# EAGLE design LARIX_V3_finish (EAGLE 6.5.0)
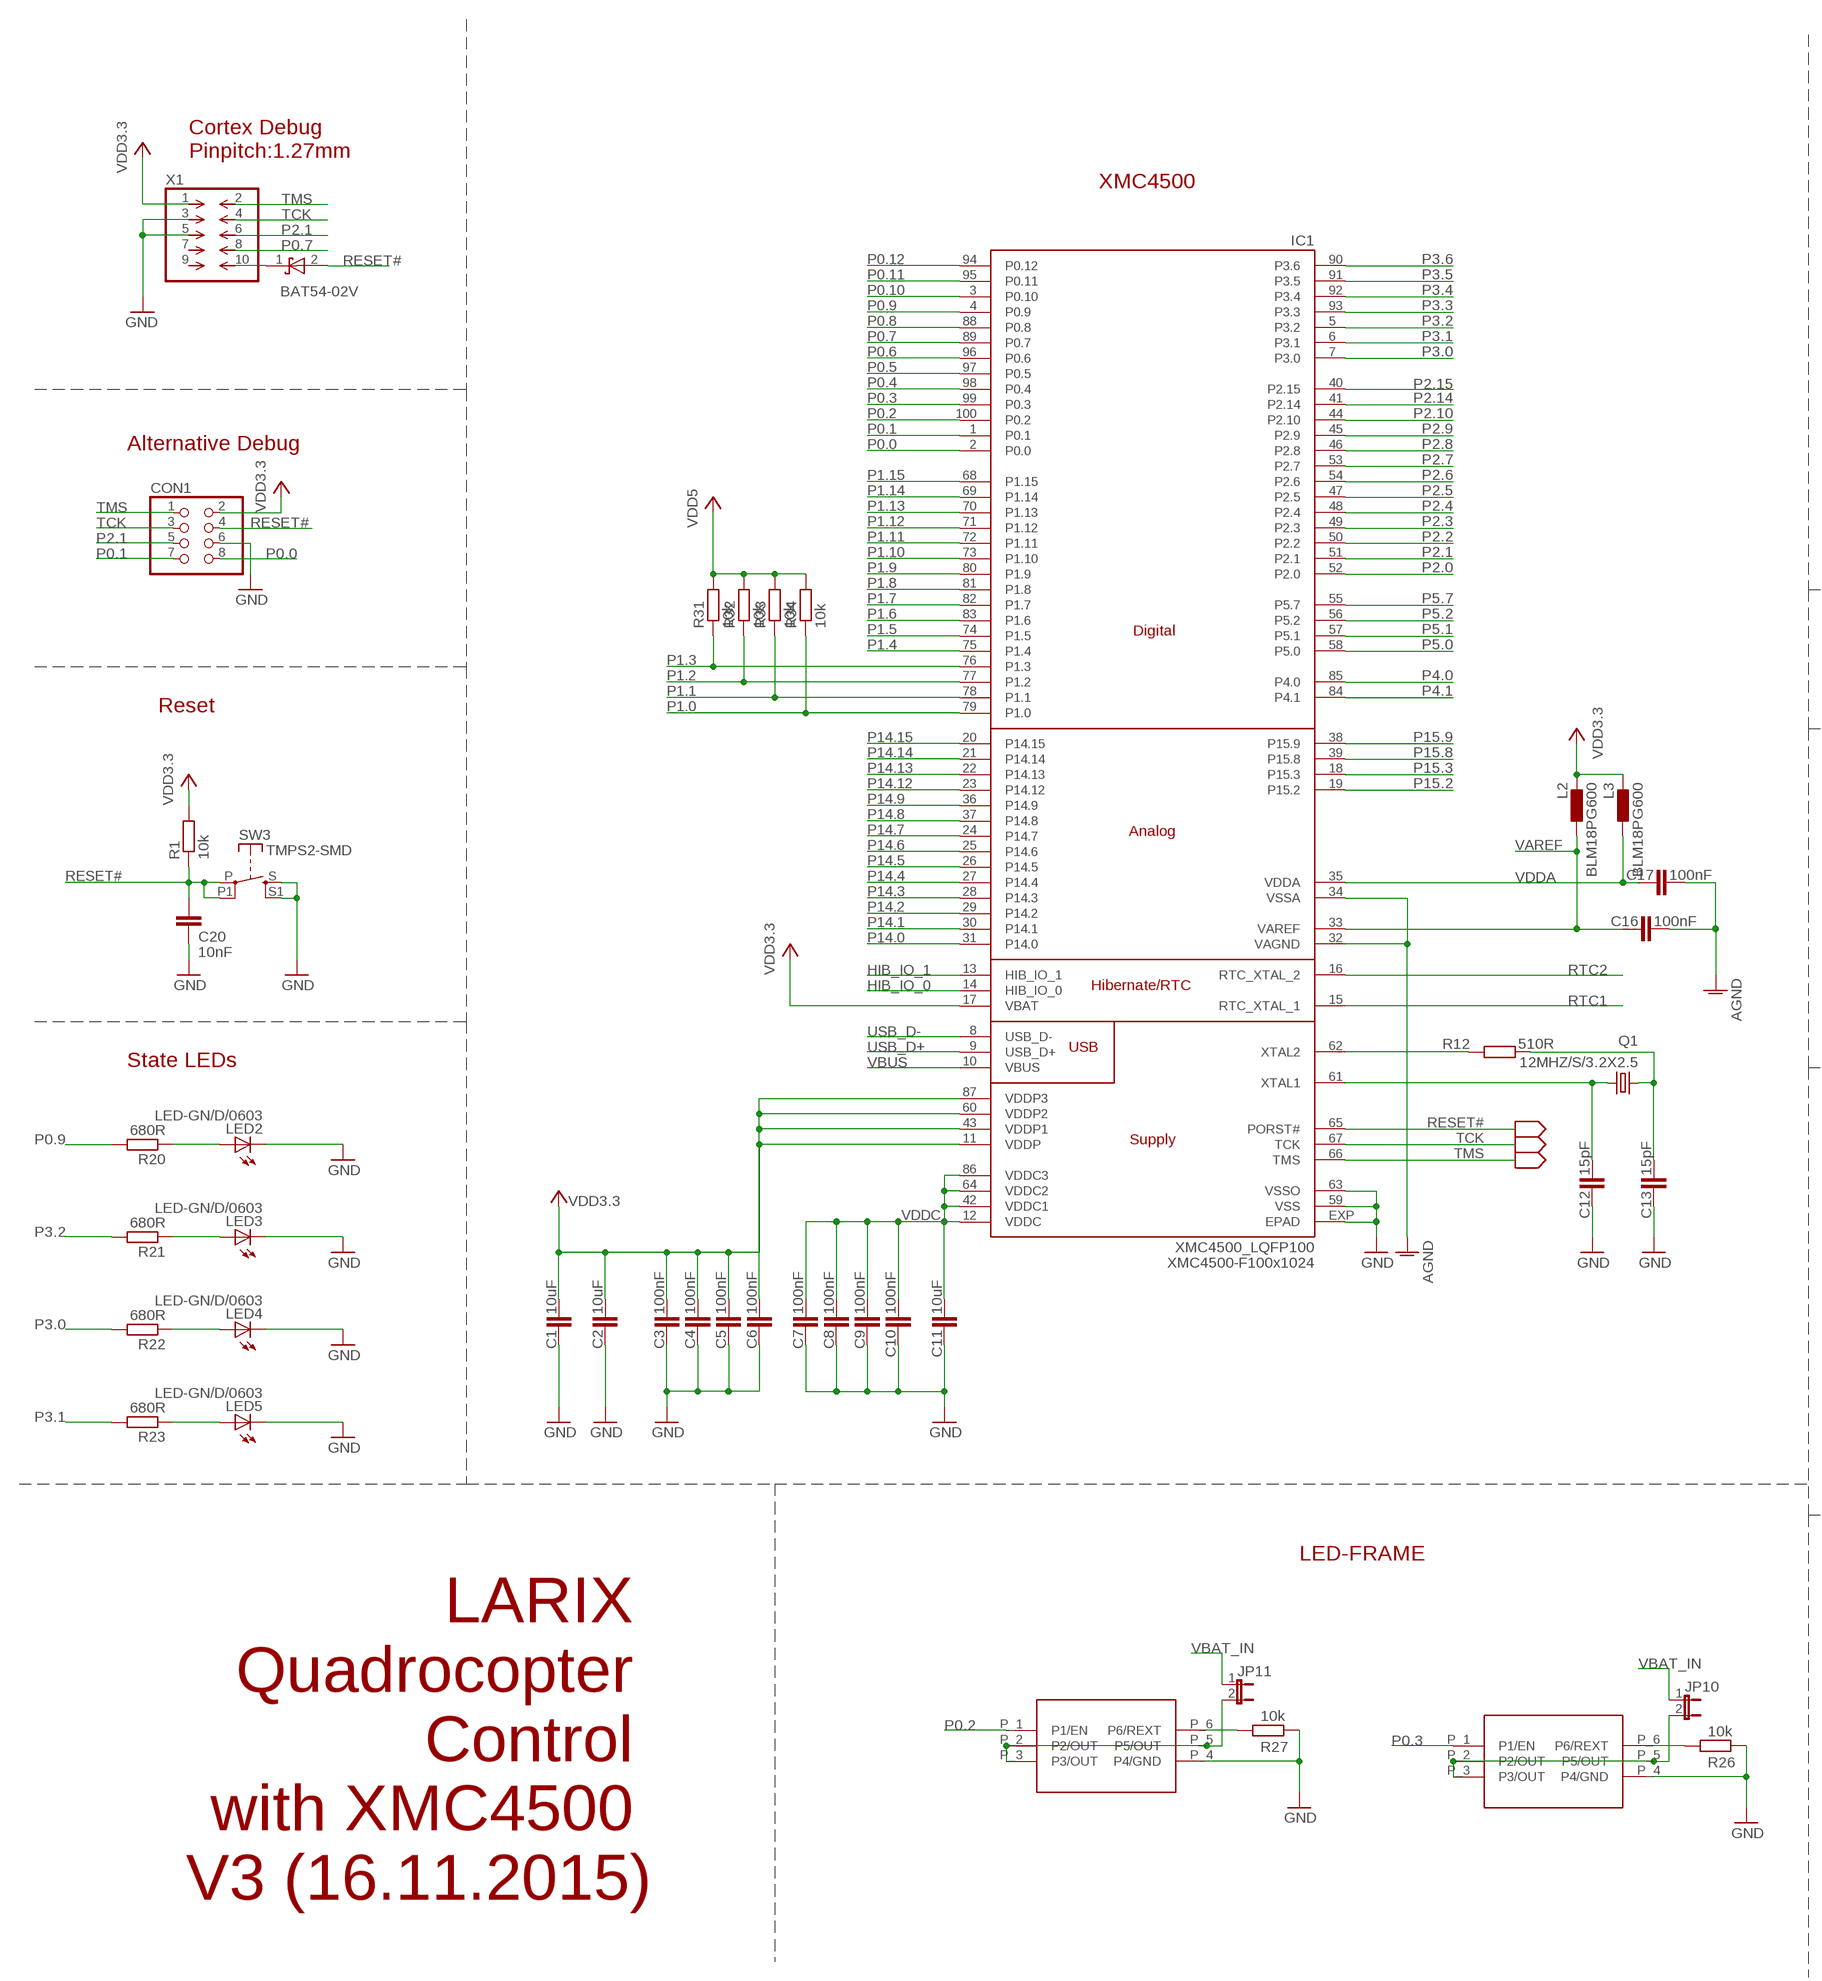
[diagram p0: schematic, sheet 1, part 1 of 2]
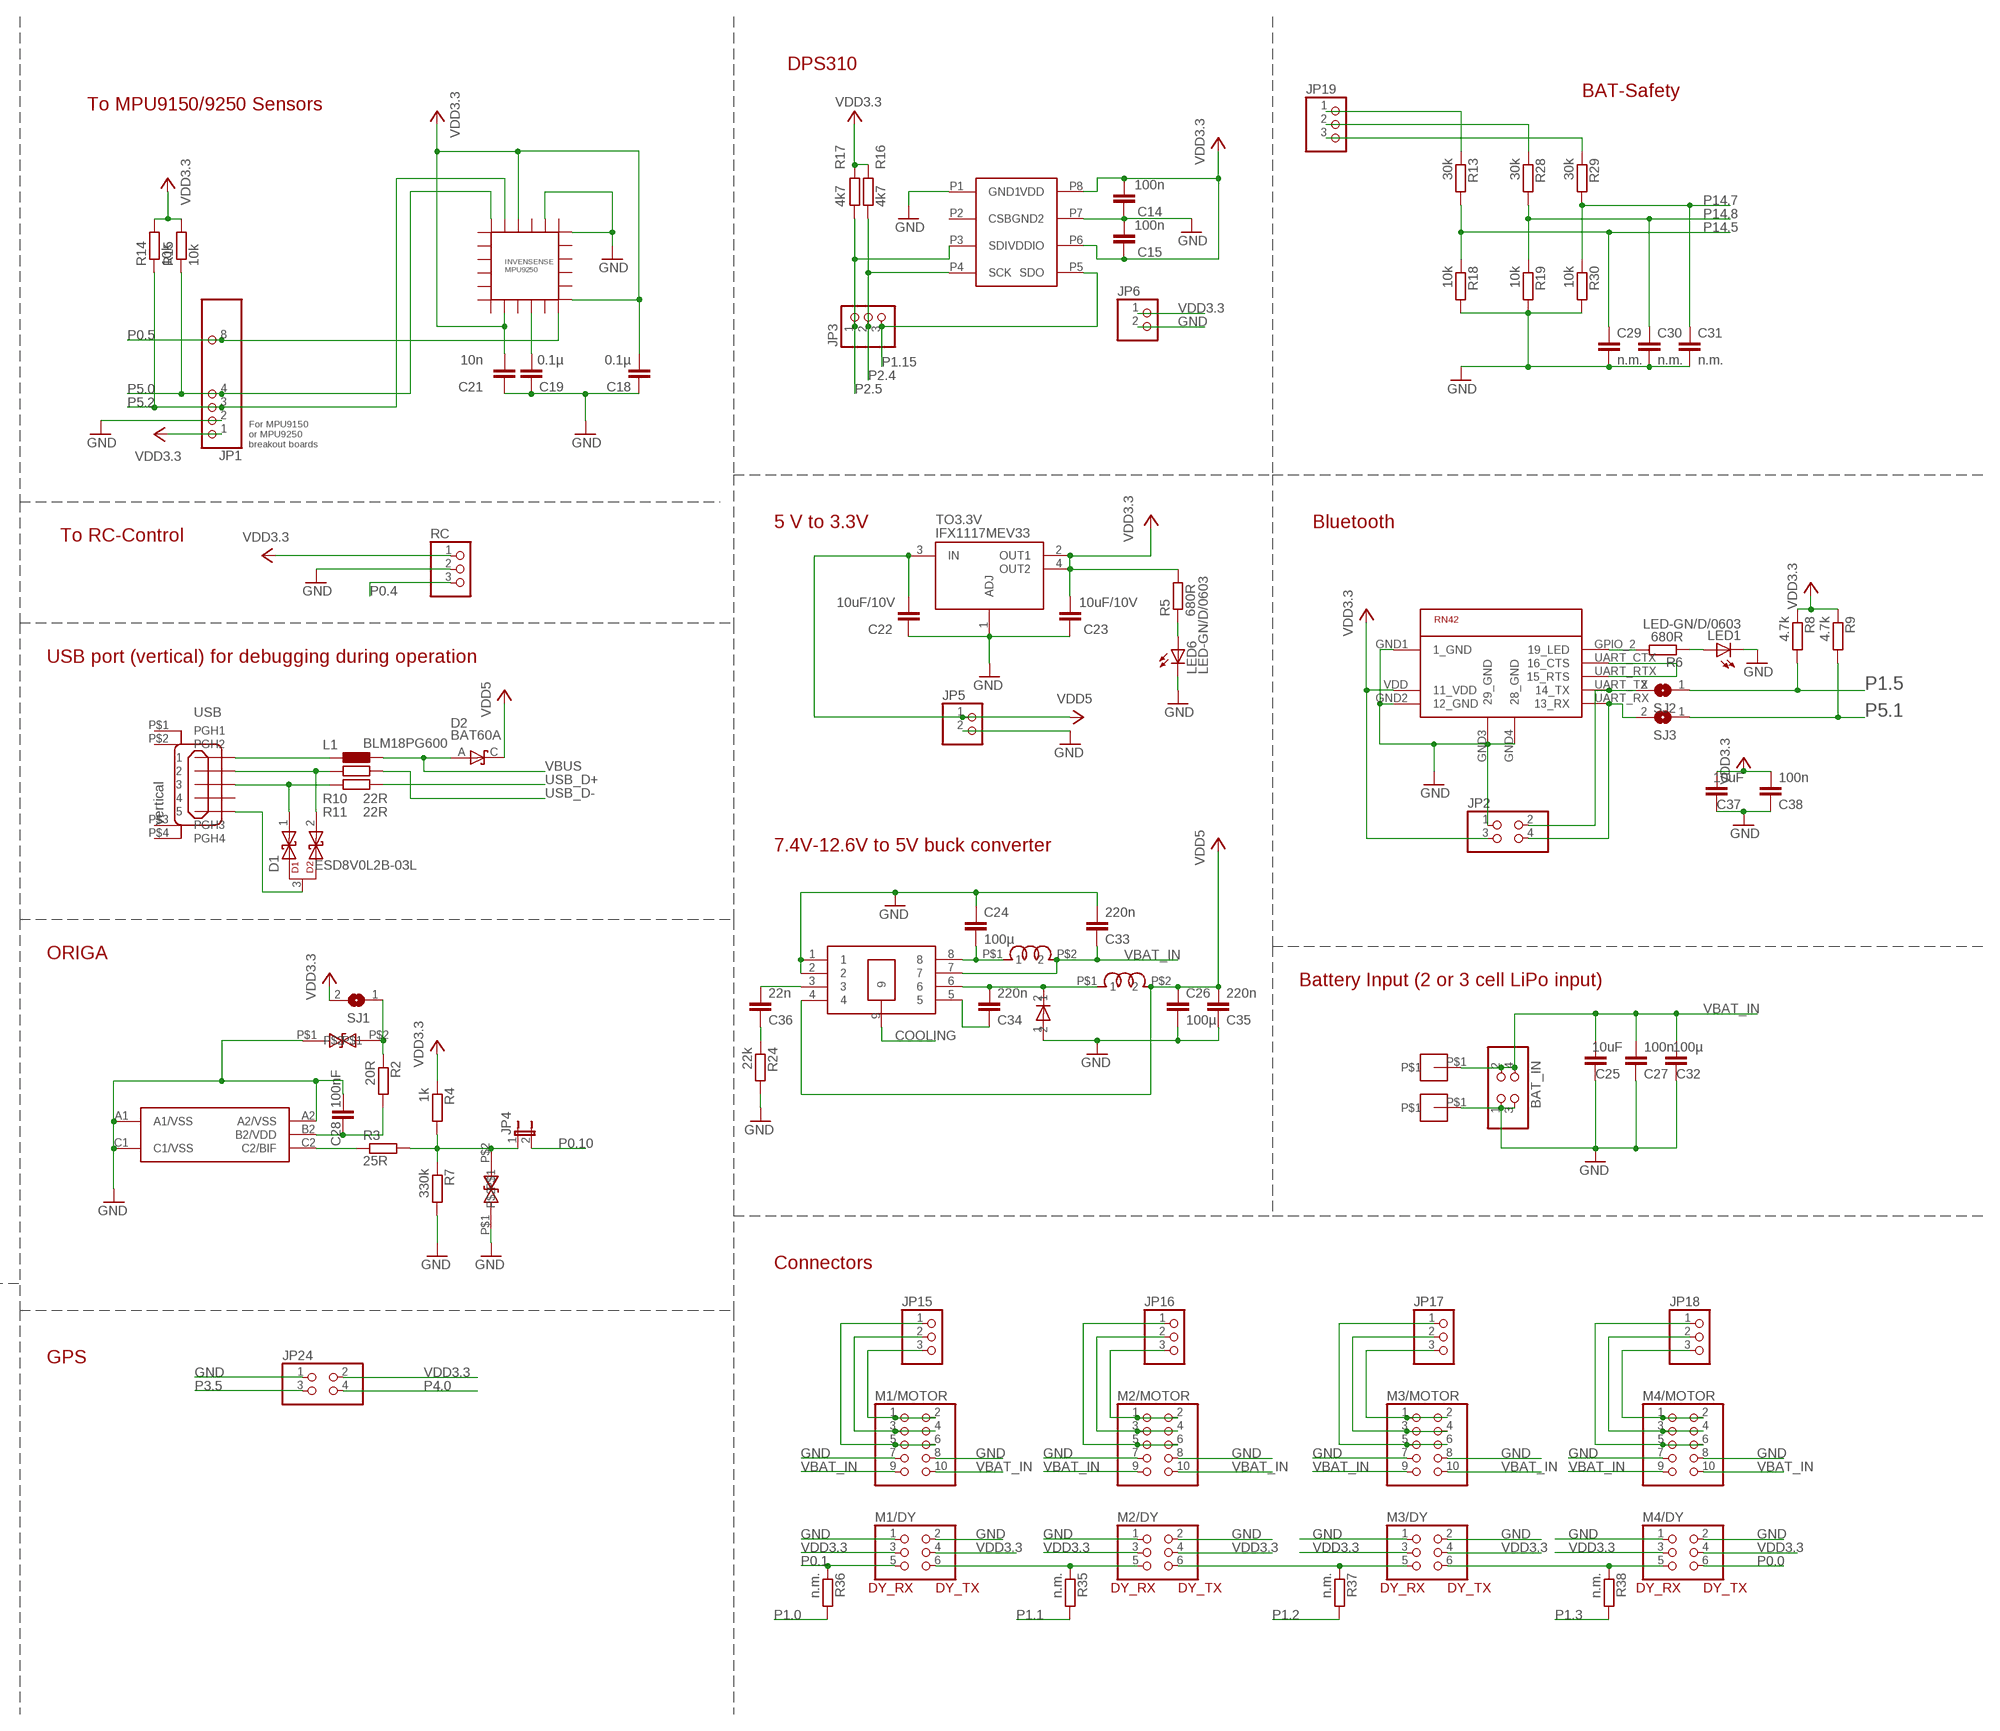
[diagram p1: schematic, sheet 1, part 2 of 2]

## Parts
47UH  WUERTH47UFCHOKE  [INDUCTANCEWUERTZ47UH]
47µH  WUERTH47UFCHOKE  [INDUCTANCEWUERTZ47UH]
BAT_IN  PINHD-2X2  [2X02]
C1  10uF  C-EUC0805K  [C0805K]
C2  10uF  C-EUC0805K  [C0805K]
C3  100nF  C-EUC0603  [C0603]
C4  100nF  C-EUC0603  [C0603]
C5  100nF  C-EUC0603  [C0603]
C6  100nF  C-EUC0603  [C0603]
C7  100nF  C-EUC0603  [C0603]
C8  100nF  C-EUC0603  [C0603]
C9  100nF  C-EUC0603  [C0603]
C10  100nF  C-EUC0603  [C0603]
C11  10uF  C-EUC0805K  [C0805K]
C12  15pF  C-EUC0603  [C0603]
C13  15pF  C-EUC0603  [C0603]
C14  100n  C-EUC0603  [C0603]
C15  100n  C-EUC0603  [C0603]
C16  100nF  C-EUC0603  [C0603]
C17  100nF  C-EUC0603  [C0603]
C18  0.1µ  C-EUC0603  [C0603]
C19  0.1µ  C-EUC0603  [C0603]
C20  10nF  C-EUC0603  [C0603]
C21  10n  C-EUC0603  [C0603]
C22  10uF/10V  C-EUC0805K  [C0805K]
C23  10uF/10V  C-EUC0805K  [C0805K]
C24  100µ  C-EUC1206K  [C1206K]
C25  10uF  C-EUC0805K  [C0805K]
C26  100µ  C-EUC1206K  [C1206K]
C27  100n  C-EUC0603  [C0603]
C28  100nF  C-EUC0603  [C0603]
C29  n.m.  C-EUC0603  [C0603]
C30  n.m.  C-EUC0603  [C0603]
C31  n.m.  C-EUC0603  [C0603]
C32  100µ  C-EUC1206  [C1206]
C33  220n  C-EUC0603  [C0603]
C34  220n  C-EUC0603  [C0603]
C35  220n  C-EUC0603  [C0603]
C36  22n  C-EUC0603  [C0603]
C37  10uF  C-EUC0805K  [C0805K]
C38  100n  C-EUC0603  [C0603]
CON1  PINHD-2X4  [2X04]
D1  ESD8V0L2B-03L  [TSLP-3-1]
D2  BAT60A  BAT60  [SOD323-R]
IC1  XMC4500_LQFP100  XMC4400_LQFP100  [P/PG-LQFP-100-11]
IC2  INVENSENSE9250EHERBY  [QFN3X3-24+]
JP1  PINHD-1X10  [1X10]
JP2  PINHD-2X2  [2X02]
JP3  PINHD-1X3  [1X03]
JP4  JP1E  [JP1]
JP5  PINHD-1X2  [1X02]
JP6  PINHD-1X2  [1X02]
JP10  JP1E  [JP1]
JP11  JP1E  [JP1]
JP15  PINHD-1X3  [1X03]
JP16  PINHD-1X3  [1X03]
JP17  PINHD-1X3  [1X03]
JP18  PINHD-1X3  [1X03]
JP19  PINHD-1X3  [1X03]
JP24  PINHD-2X2  [2X02]
L1  BLM18PG600  L_EU_L0603  [L1608]
L2  BLM18PG600  L_EU_L0603  [L1608]
L3  BLM18PG600  L_EU_L0603  [L1608]
LED1  LED-GN/D/0603  LEDCHIPLED_0603  [CHIPLED_0603]
LED2  LED-GN/D/0603  LEDCHIPLED_0603  [CHIPLED_0603]
LED3  LED-GN/D/0603  LEDCHIPLED_0603  [CHIPLED_0603]
LED4  LED-GN/D/0603  LEDCHIPLED_0603  [CHIPLED_0603]
LED5  LED-GN/D/0603  LEDCHIPLED_0603  [CHIPLED_0603]
LED6  LED-GN/D/0603  LEDCHIPLED_0603  [CHIPLED_0603]
M1/DY  PINHD-2X3  [2X03]
M1/MOTOR  PINHD-2X5  [2X05]
M2/DY  PINHD-2X3  [2X03]
M2/MOTOR  PINHD-2X5  [2X05]
M3/DY  PINHD-2X3  [2X03]
M3/MOTOR  PINHD-2X5  [2X05]
M4/DY  PINHD-2X3  [2X03]
M4/MOTOR  PINHD-2X5  [2X05]
Q1  12MHZ/S/3.2X2.5  NX3225_2  [32X25_4PAD]
R1  10k  R-EU_R0603  [R0603]
R2  20R  R-EU_R0603  [R0603]
R3  25R  R-EU_R0603  [R0603]
R4  1k  R-EU_R0603  [R0603]
R5  680R  R-EU_R0603  [R0603]
R6  680R  R-EU_R0603  [R0603]
R7  330k  R-EU_R0603  [R0603]
R8  4.7k  R-EU_R0603  [R0603]
R9  4.7k  R-EU_R0603  [R0603]
R10  22R  R-EU_R0603  [R0603]
R11  22R  R-EU_R0603  [R0603]
R12  510R  R-EU_R0603  [R0603]
R13  30k  R-EU_R0603  [R0603]
R14  10k  R-EU_R0603  [R0603]
R15  10k  R-EU_R0603  [R0603]
R16  4k7  R-EU_R0603  [R0603]
R17  4k7  R-EU_R0603  [R0603]
R18  10k  R-EU_R0603  [R0603]
R19  10k  R-EU_R0603  [R0603]
R20  680R  R-EU_R0603  [R0603]
R21  680R  R-EU_R0603  [R0603]
R22  680R  R-EU_R0603  [R0603]
R23  680R  R-EU_R0603  [R0603]
R24  22k  R-EU_R0603  [R0603]
R26  10k  R-EU_R0603  [R0603]
R27  10k  R-EU_R0603  [R0603]
R28  30k  R-EU_R0603  [R0603]
R29  30k  R-EU_R0603  [R0603]
R30  10k  R-EU_R0603  [R0603]
R31  10k  R-EU_R0603  [R0603]
R32  10k  R-EU_R0603  [R0603]
R33  10k  R-EU_R0603  [R0603]
R34  10k  R-EU_R0603  [R0603]
R35  n.m.  R-EU_R0603  [R0603]
R36  n.m.  R-EU_R0603  [R0603]
R37  n.m.  R-EU_R0603  [R0603]
R38  n.m.  R-EU_R0603  [R0603]
RC  PINHD-1X3  [1X03]
SJ1  SJ  [SJ]
SJ2  SJ  [SJ]
SJ3  SJ  [SJ]
SW3  TMPS2-SMD  FSM2JSMA  [FSM2JSMA]
TO3.3V  IFX1117MEV33  IFX1117  [SOT223]
U$7  INF-PG-DSO-8-27_N_1  [INF-PG-DSO-8-27_N_1PRIMARY]
U$8  DPS310DRUCKSENSOR  [LGA8R125P0X4_500X300X120]
U$9  ESD218-B1-02EL  [TSLP-2-20]
U$11  ORIGA2L  [WLB-5]
U$12  PAD-BATTERY  [BATT-SOLDER]
U$13  BLUETOOTHRN42+SHIELD  [RN42+SHIELD]
U$14  PAD-BATTERY  [BATT-SOLDER]
U$16  INF-SOD323_V_1  [INF-SOD323_V_1PRIMARY]
U$18  BCU320  [SC74]
U$20  BCU320  [SC74]
U$22  ESD218-B1-02EL  [TSLP-2-20]
USB  vertical  MICRO_USB_VERTICAL  [USBVERTICAL]
V1  BAT54-02V  [SC79]
X1  FTSH-105-01-F-D-K  [FTSH-105-01-F-D-K]

## Nets
AGND: C16.2 C17.2 IC1.32(VAGND) IC1.34(VSSA)
COOLING: U$7.9
GND: BAT_IN.1 BAT_IN.3 C1.2 C2.2 C3.2 C4.2 C5.2 C6.2 C7.2 C8.2 C9.2 C10.2 C11.2 C12.2 C13.2 C14.2 C15.1 C18.1 C19.1 C20.2 C21.1 C22.2 C23.2 C24.1 C25.2 C26.2 C27.2 C28.1 C29.2 C30.2 C31.2 C32.2 C33.1 C35.2 C37.2 C38.2 CON1.6 D1.3 IC1.59(VSS) IC1.63(VSSO) IC1.EXP(EPAD) IC2.18 IC2.20 JP1.2 JP2.1 JP5.2 JP6.2 JP24.1 LED1.C LED2.C LED3.C LED4.C LED5.C LED6.C M1/DY.1 M1/DY.2 M1/MOTOR.7 M1/MOTOR.8 M2/DY.1 M2/DY.2 M2/MOTOR.7 M2/MOTOR.8 M3/DY.1 M3/DY.2 M3/MOTOR.7 M3/MOTOR.8 M4/DY.1 M4/DY.2 M4/MOTOR.7 M4/MOTOR.8 R7.2 R18.2 R19.2 R24.2 R26.2 R27.2 R30.2 RC.2 SW3.S SW3.S1(S) TO3.3V.1(ADJ) U$7.1 U$7.2 U$8.P1(GND1) U$8.P7(GND2) U$9.P$1 U$11.A1(A1/VSS) U$11.A2(A2/VSS) U$11.C1(C1/VSS) U$13.GND1(1_GND) U$13.GND2(12_GND) U$13.GND3(29_GND) U$13.GND4(28_GND) U$14.P$1 U$16.1 U$18.P_4(P4/GND) U$20.P_4(P4/GND) U$22.P$1 USB.5 X1.3 X1.5
HIB_IO_0: IC1.14(HIB_IO_0)
HIB_IO_1: IC1.13(HIB_IO_1)
N$1: LED2.A R20.1
N$2: C28.2 R2.2 U$11.B2(B2/VDD)
N$3: LED3.A R21.1
N$4: C36.1 U$7.3
N$6: IC1.62(XTAL2) R12.1
N$7: C13.1 Q1.3 R12.2
N$8: C12.1 IC1.61(XTAL1) Q1.1
N$9: JP4.1 R3.2 R4.2 R7.1 U$22.P$2
N$10: R2.1 SJ1.1 U$9.P$2
N$11: L1.2 USB.1
N$12: R3.1 U$11.C2(C2/BIF)
N$13: D1.2 R10.1 USB.2
N$14: JP15.1 M1/MOTOR.5 M1/MOTOR.6
N$15: LED6.A R5.1
N$16: M2/DY.6 M3/DY.5 R37.1
N$17: C36.2 R24.1
N$18: LED1.A R6.1
N$19: V1.1(C) X1.10
N$20: C19.2 IC2.10
N$21: JP15.2 M1/MOTOR.3 M1/MOTOR.4
N$22: LED4.A R22.1
N$24: LED5.A R23.1
N$25: JP15.3 M1/MOTOR.1 M1/MOTOR.2
N$26: R6.2 U$13.GPIO_2(19_LED)
N$27: U$13.UART_CTX(16_CTS) U$13.UART_RTX(15_RTS)
N$28: 47µH.P$1 C24.2 U$7.8
N$30: 47UH.P$1 C34.1 U$7.6 U$16.2
N$31: R26.1 U$18.P_6(P6/REXT)
N$32: JP10.2 U$18.P_2(P2/OUT) U$18.P_3(P3/OUT) U$18.P_5(P5/OUT)
N$33: R27.1 U$20.P_6(P6/REXT)
N$34: JP11.2 U$20.P_2(P2/OUT) U$20.P_3(P3/OUT) U$20.P_5(P5/OUT)
N$35: JP16.1 M2/MOTOR.5 M2/MOTOR.6
N$36: D1.1 R11.1 USB.3+
N$37: JP19.1 R13.1
N$38: JP16.3 M2/MOTOR.1 M2/MOTOR.2
N$40: JP16.2 M2/MOTOR.3 M2/MOTOR.4
N$41: JP19.2 R28.1
N$42: JP18.1 M4/MOTOR.5 M4/MOTOR.6
N$43: JP19.3 R29.1
N$45: JP18.3 M4/MOTOR.1 M4/MOTOR.2
N$46: JP18.2 M4/MOTOR.3 M4/MOTOR.4
N$47: C34.2 U$7.5
N$49: JP17.1 M3/MOTOR.5 M3/MOTOR.6
N$50: JP17.2 M3/MOTOR.3 M3/MOTOR.4
N$53: JP17.3 M3/MOTOR.1 M3/MOTOR.2
N$54: M3/DY.6 M4/DY.5 R38.1
N$55: M1/DY.6 M2/DY.5 R35.1
P0.0: CON1.8 IC1.2(P0.0) M4/DY.6
P0.1: CON1.7 IC1.1(P0.1) M1/DY.5 R36.1
P0.2: IC1.100(P0.2) U$20.P_1(P1/EN)
P0.3: IC1.99(P0.3) U$18.P_1(P1/EN)
P0.4: IC1.98(P0.4) RC.3
P0.5: IC1.97(P0.5) IC2.12 JP1.8
P0.6: IC1.96(P0.6)
P0.7: IC1.89(P0.7) X1.8
P0.8: IC1.88(P0.8)
P0.9: IC1.4(P0.9) R20.2
P0.10: IC1.3(P0.10) JP4.2
P0.11: IC1.95(P0.11)
P0.12: IC1.94(P0.12)
P1.0: IC1.79(P1.0) R34.1 R36.2
P1.1: IC1.78(P1.1) R33.1 R35.2
P1.2: IC1.77(P1.2) R32.1 R37.2
P1.3: IC1.76(P1.3) R31.1 R38.2
P1.4: IC1.75(P1.4)
P1.5: IC1.74(P1.5) R8.2 SJ2.1
P1.5S: JP2.2 SJ2.2 U$13.UART_TX(14_TX)
P1.6: IC1.83(P1.6)
P1.7: IC1.82(P1.7)
P1.8: IC1.81(P1.8)
P1.9: IC1.80(P1.9)
P1.10: IC1.73(P1.10)
P1.11: IC1.72(P1.11)
P1.12: IC1.71(P1.12)
P1.13: IC1.70(P1.13)
P1.14: IC1.69(P1.14)
P1.15: IC1.68(P1.15) JP3.3 U$8.P5(SDO)
P2.0: IC1.52(P2.0)
P2.1: CON1.5 IC1.51(P2.1) X1.6
P2.2: IC1.50(P2.2)
P2.3: IC1.49(P2.3)
P2.4: IC1.48(P2.4) JP3.2 R16.2 U$8.P4(SCK)
P2.5: IC1.47(P2.5) JP3.1 R17.2 U$8.P3(SDI)
P2.6: IC1.54(P2.6)
P2.7: IC1.53(P2.7)
P2.8: IC1.46(P2.8)
P2.9: IC1.45(P2.9)
P2.10: IC1.44(P2.10)
P2.14: IC1.41(P2.14)
P2.15: IC1.40(P2.15)
P3.0: IC1.7(P3.0) R22.2
P3.1: IC1.6(P3.1) R23.2
P3.2: IC1.5(P3.2) R21.2
P3.3: IC1.93(P3.3)
P3.4: IC1.92(P3.4)
P3.5: IC1.91(P3.5) JP24.3
P3.6: IC1.90(P3.6)
P4.0: IC1.85(P4.0) JP24.4
P4.1: IC1.84(P4.1)
P5.0: IC1.58(P5.0) IC2.24 JP1.4 R15.1
P5.1: IC1.57(P5.1) R9.2 SJ3.1
P5.1S: JP2.4 SJ3.2 U$13.UART_RX(13_RX)
P5.2: IC1.56(P5.2) IC2.23 JP1.3 R14.1
P5.7: IC1.55(P5.7)
P14.0: IC1.31(P14.0)
P14.1: IC1.30(P14.1)
P14.2: IC1.29(P14.2)
P14.3: IC1.28(P14.3)
P14.4: IC1.27(P14.4)
P14.5: C29.1 IC1.26(P14.5) R13.2 R18.1
P14.6: IC1.25(P14.6)
P14.7: C31.1 IC1.24(P14.7) R29.2 R30.1
P14.8: C30.1 IC1.37(P14.8) R19.1 R28.2
P14.9: IC1.36(P14.9)
P14.12: IC1.23(P14.12)
P14.13: IC1.22(P14.13)
P14.14: IC1.21(P14.14)
P14.15: IC1.20(P14.15)
P15.2: IC1.19(P15.2)
P15.3: IC1.18(P15.3)
P15.8: IC1.39(P15.8)
P15.9: IC1.38(P15.9)
RESET#: C20.1 CON1.4 IC1.65(PORST#) R1.1 SW3.P SW3.P1(P) V1.2(A)
RTC1: IC1.15(RTC_XTAL_1)
RTC2: IC1.16(RTC_XTAL_2)
TCK: CON1.3 IC1.67(TCK) X1.4
TMS: CON1.1 IC1.66(TMS) X1.2
USB_D+: IC1.9(USB_D+) R11.2
USB_D-: IC1.8(USB_D-) R10.2
VAREF: C16.1 IC1.33(VAREF) L2.1
VBAT_IN: 47µH.P$2 BAT_IN.2 BAT_IN.4 C25.1 C27.1 C32.1 C33.2 JP10.1 JP11.1 M1/MOTOR.9 M1/MOTOR.10 M2/MOTOR.9 M2/MOTOR.10 M3/MOTOR.9 M3/MOTOR.10 M4/MOTOR.9 M4/MOTOR.10 U$7.7 U$12.P$1
VBUS: D2.A IC1.10(VBUS) L1.1
VDD3.3: C1.1 C2.1 C3.1 C4.1 C5.1 C6.1 C14.1 C15.2 C18.2 C21.2 C23.1 C37.1 C38.1 CON1.2 IC1.11(VDDP) IC1.17(VBAT) IC1.43(VDDP1) IC1.60(VDDP2) IC1.87(VDDP3) IC2.8 IC2.13 IC2.22 JP1.1 JP2.3 JP6.1 JP24.2 L2.2 L3.2 M1/DY.3 M1/DY.4 M2/DY.3 M2/DY.4 M3/DY.3 M3/DY.4 M4/DY.3 M4/DY.4 R1.2 R4.1 R5.2 R8.1 R9.1 R14.2 R15.2 R16.1 R17.1 RC.1 SJ1.2 TO3.3V.2(OUT1) TO3.3V.4(OUT2) U$8.P6(VDDIO) U$8.P8(VDD) U$13.VDD(11_VDD) X1.1
VDD5: 47UH.P$2 C22.1 C26.1 C35.1 D2.C JP5.1 R31.2 R32.2 R33.2 R34.2 TO3.3V.3(IN) U$7.4
VDDA: C17.1 IC1.35(VDDA) L3.1
VDDC: C7.1 C8.1 C9.1 C10.1 C11.1 IC1.12(VDDC) IC1.42(VDDC1) IC1.64(VDDC2) IC1.86(VDDC3)
Unconnected: IC2.1 IC2.2 IC2.3 IC2.4 IC2.5 IC2.6 IC2.7 IC2.9 IC2.11 IC2.14 IC2.15 IC2.16 IC2.17 IC2.19 IC2.21 U$8.P2(CSB) USB.4 USB.P$1(PGH1) USB.P$2(PGH2) USB.P$3(PGH3) USB.P$4(PGH4) X1.7 X1.9

## Notes on the sheet
- DPS310
- BAT-Safety
- To MPU9150/9250 Sensors
- Cortex Debug
  Pinpitch:1.27mm
- XMC4500
- Alternative Debug
- For MPU9150
  or MPU9250 
  breakout boards
- 5 V to 3.3V | Bluetooth
- To RC-Control
- Reset
- USB port (vertical) for debugging during operation
- 7.4V-12.6V to 5V buck converter
- State LEDs
- ORIGA
- Battery Input (2 or 3 cell LiPo input)
- XMC4500-F100x1024
- Connectors
- LED-FRAME
- GPS
- DY_RX | DY_TX | DY_RX | DY_TX | DY_RX | DY_TX | DY_RX | DY_TX
- LARIX 
  Quadrocopter 
  Control 
  with XMC4500 
  V3 (16.11.2015)

## Library data of the parts
47UH 47µH = 47µHWuerthChoke:WUERTH47UFCHOKE
BAT_IN JP2 JP24 = pinhead:PINHD-2X2: PIN HEADER
C1 C2 C11 C22 C23 C25 C37 = HMI_OLED-V1:C-EU: CAPACITOR, European symbol
C3-C10 C12-C21 C24 C26-C36 C38 = resistor:C-EU: CAPACITOR, European symbol
CON1 = pinhead:PINHD-2X4: PIN HEADER
D1 = DsDiod:ESD8V0L2B-03L
D2 = BAT60:BAT60; A: A; B: B
IC1 = XMC4000_v4.16:XMC4400_LQFP100
IC2 = invensense9250:INVENSENSE9250: Herbys Model of a invensense 9250
JP1 = pinhead:PINHD-1X10: PIN HEADER
JP3 JP15-JP19 RC = pinhead:PINHD-1X3: PIN HEADER
JP4 JP10 JP11 = jumper:JP1E: JUMPER
JP5 JP6 = pinhead:PINHD-1X2: PIN HEADER
L1-L3 = PDFerr:L_EU_
LED1-LED6 = led:LED: LED OSRAM: - CHIPLED LG R971, LG N971, LY N971, LG Q971, LY Q971, LO R971, LY R971 LH N974, LH R974 LS Q976, LO Q976, LY Q976 LO Q996 - Hyper CHIPLED LW Q18S LB Q993, LB Q99A, LB R99A - SideLED LS A670, LO A670, LY A670, LG A670, LP A670 LB A673, LV A673, LT A673, LW A673 LH A674 LY A675 LS A676, LA A676, LO A676, LY A676, LW A676 LS A679, LY A679, LG A679 - Hyper Micro SIDELED® LS Y876, LA Y876, LO Y876, LY Y876 LT Y87S - SmartLED LW L88C, LW L88S LB L89C, LB L89S, LG L890 LS L89K, LO L89K, LY L89K LS L896, LA L896, LO L896, LY L896 - TOPLED LS T670, LO T670, LY T670, LG T670, LP T670 LSG T670, LSP T670, LSY T670, LOP T670, LYG T670 LG T671, LOG T671, LSG T671 LB T673, LV T673, LT T673, LW T673 LH T674 LS T676, LA T676, LO T676, LY T676, LB T676, LH T676, LSB T676, LW T676 LB T67C, LV T67C, LT T67C, LS T67K, LO T67K, LY T67K, LW E67C LS E67B, LA E67B, LO E67B, LY E67B, LB E67C, LV E67C, LT E67C LW T67C LS T679, LY T679, LG T679 LS T770, LO T770, LY T770, LG T770, LP T770 LB T773, LV T773, LT T773, LW T773 LH T774 LS E675, LA E675, LY E675, LS T675 LS T776, LA T776, LO T776, LY T776, LB T776 LHGB T686 LT T68C, LB T68C - Hyper Mini TOPLED® LB M676 - Mini TOPLED Santana® LG M470 LS M47K, LO M47K, LY M47K Source: http://www.osram.convergy.de - LUMILED® LXK2-PW12-R00, LXK2-PW12-S00, LXK2-PW14-U00, LXK2-PW14-V00 LXK2-PM12-R00, LXK2-PM12-S00, LXK2-PM14-U00 LXK2-PE12-Q00, LXK2-PE12-R00, LXK2-PE12-S00, LXK2-PE14-T00, LXK2-PE14-U00 LXK2-PB12-K00, LXK2-PB12-L00, LXK2-PB12-M00, LXK2-PB14-N00, LXK2-PB14-P00, LXK2-PB14-Q00 LXK2-PR12-L00, LXK2-PR12-M00, LXK2-PR14-Q00, LXK2-PR14-R00 LXK2-PD12-Q00, LXK2-PD12-R00, LXK2-PD12-S00 LXK2-PH12-R00, LXK2-PH12-S00 LXK2-PL12-P00, LXK2-PL12-Q00, LXK2-PL12-R00 Source: www.luxeon.com
M1/DY M2/DY M3/DY M4/DY = pinhead:PINHD-2X3: PIN HEADER
M1/MOTOR M2/MOTOR M3/MOTOR M4/MOTOR = pinhead:PINHD-2X5: PIN HEADER
Q1 = Quarz:NX3225_2
R1 R10 R11 R14-R17 R26 R27 R31-R34 = resistor:R-EU_: RESISTOR, European symbol
R2-R9 R12 R13 R18-R24 R28-R30 R35-R38 = DsR:R-EU_R0603
SJ1-SJ3 = jumper:SJ: SMD solder JUMPER
SW3 = MSwitch:FSM2JSMA
TO3.3V = IvregL:IFX1117
U$7 = Infineon-DCDC-91041 - DSO-8:INF-PG-DSO-8-27_N_1
U$8 = drucksensorDPS310:DPS310DRUCKSENSOR
U$9 U$22 = ESD218-B1:ESD218-B1-02EL
U$11 = ORIGA:ORIGA2L
U$12 U$14 = pad_battery:PAD-BATTERY
U$13 = bluetoothRN42:BLUETOOTHRN42+SHIELD
U$16 = BAS21-03W_INF-SOD323V:INF-SOD323_V_1
U$18 U$20 = LEDtreiber BCR320U:BCU320
USB = XMC4500_Relax-V1+USBvertical:MICRO_USB_VERTICAL
V1 = XMC4500_Relax-V1+USBvertical:BAT54-02V
X1 = Xtv127:FTSH-105-01-F-D-K

## Board
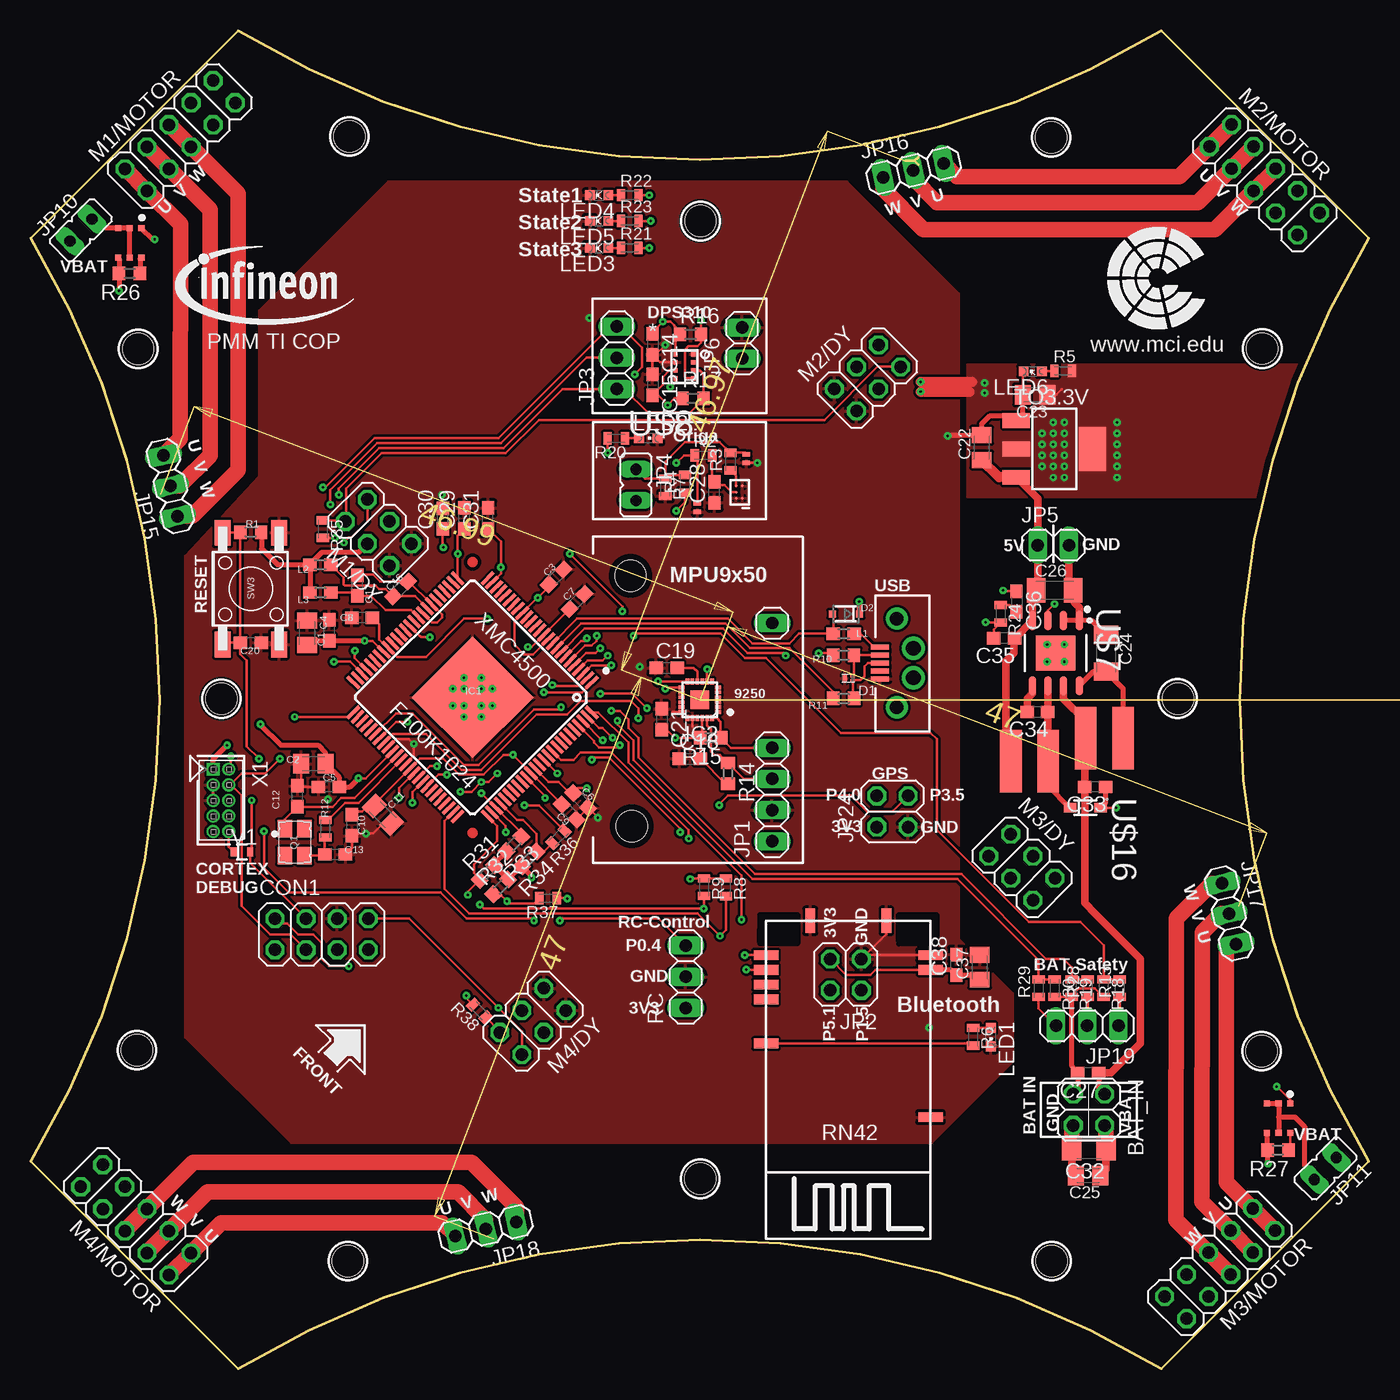
[diagram p2: board, top side]
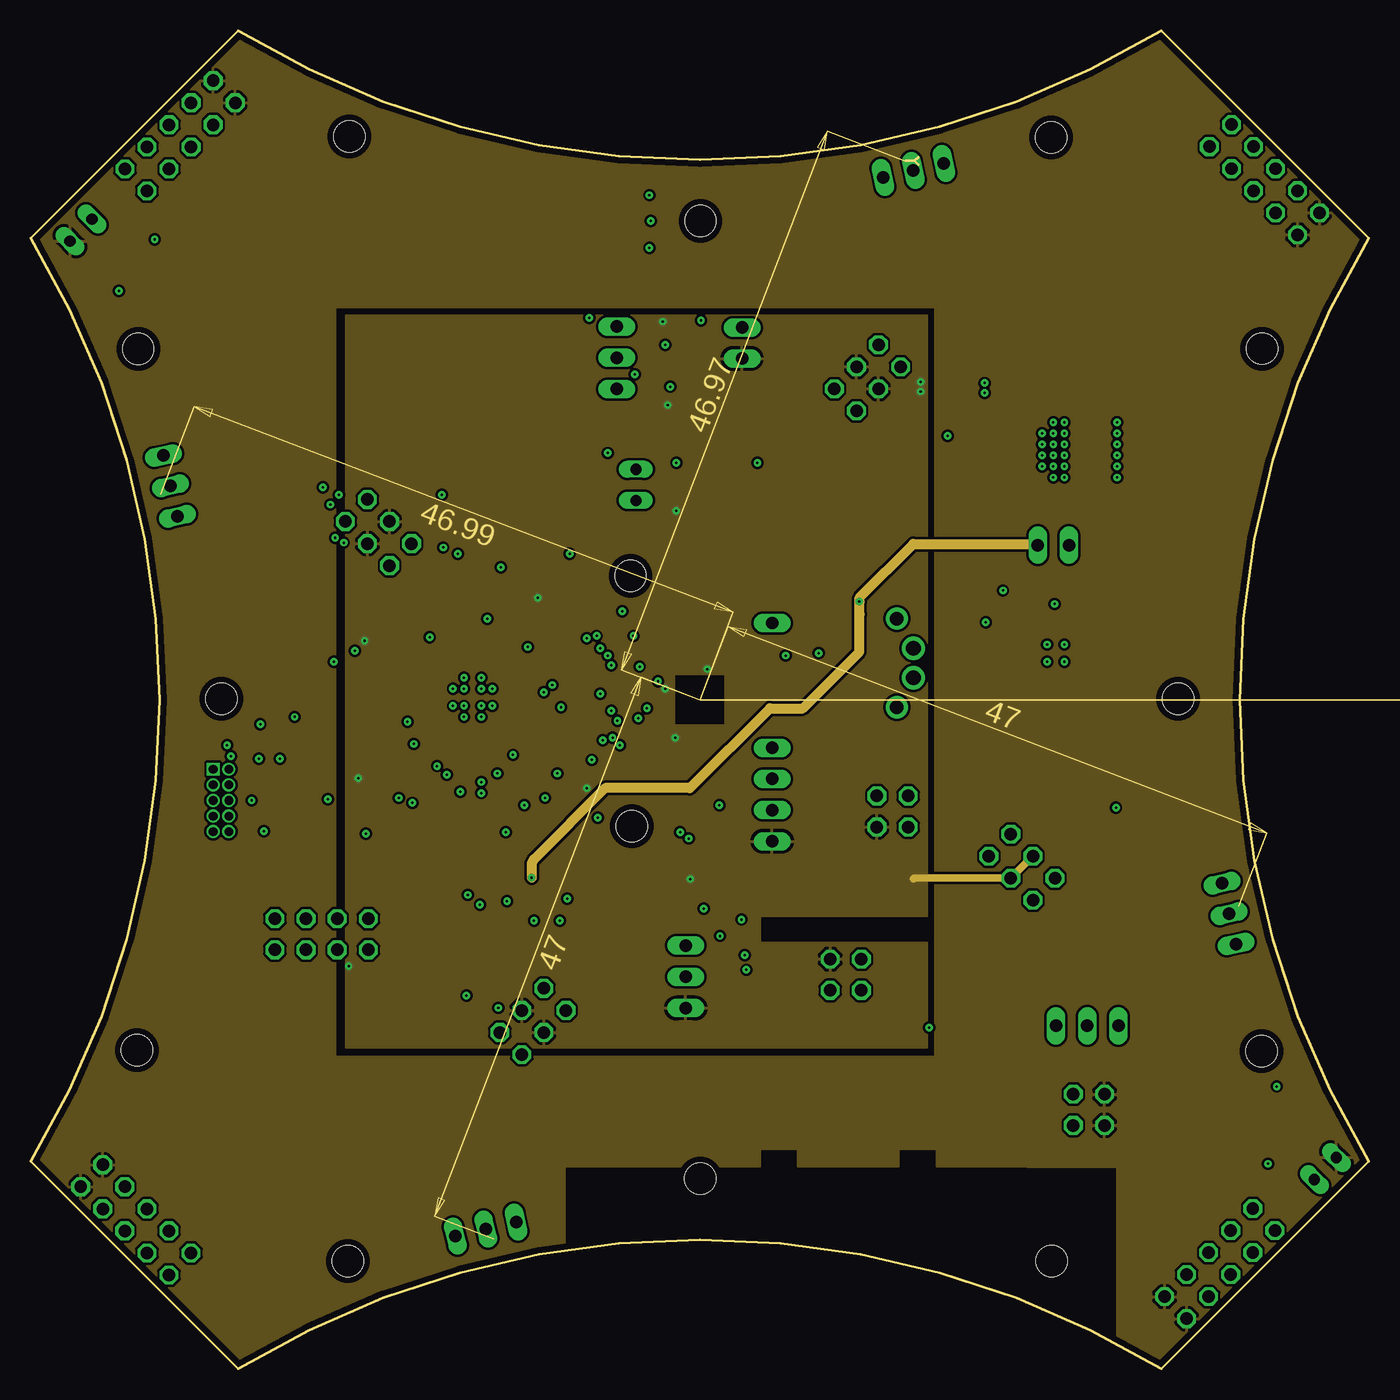
[diagram p3: board, inner layer VCC_VDD]
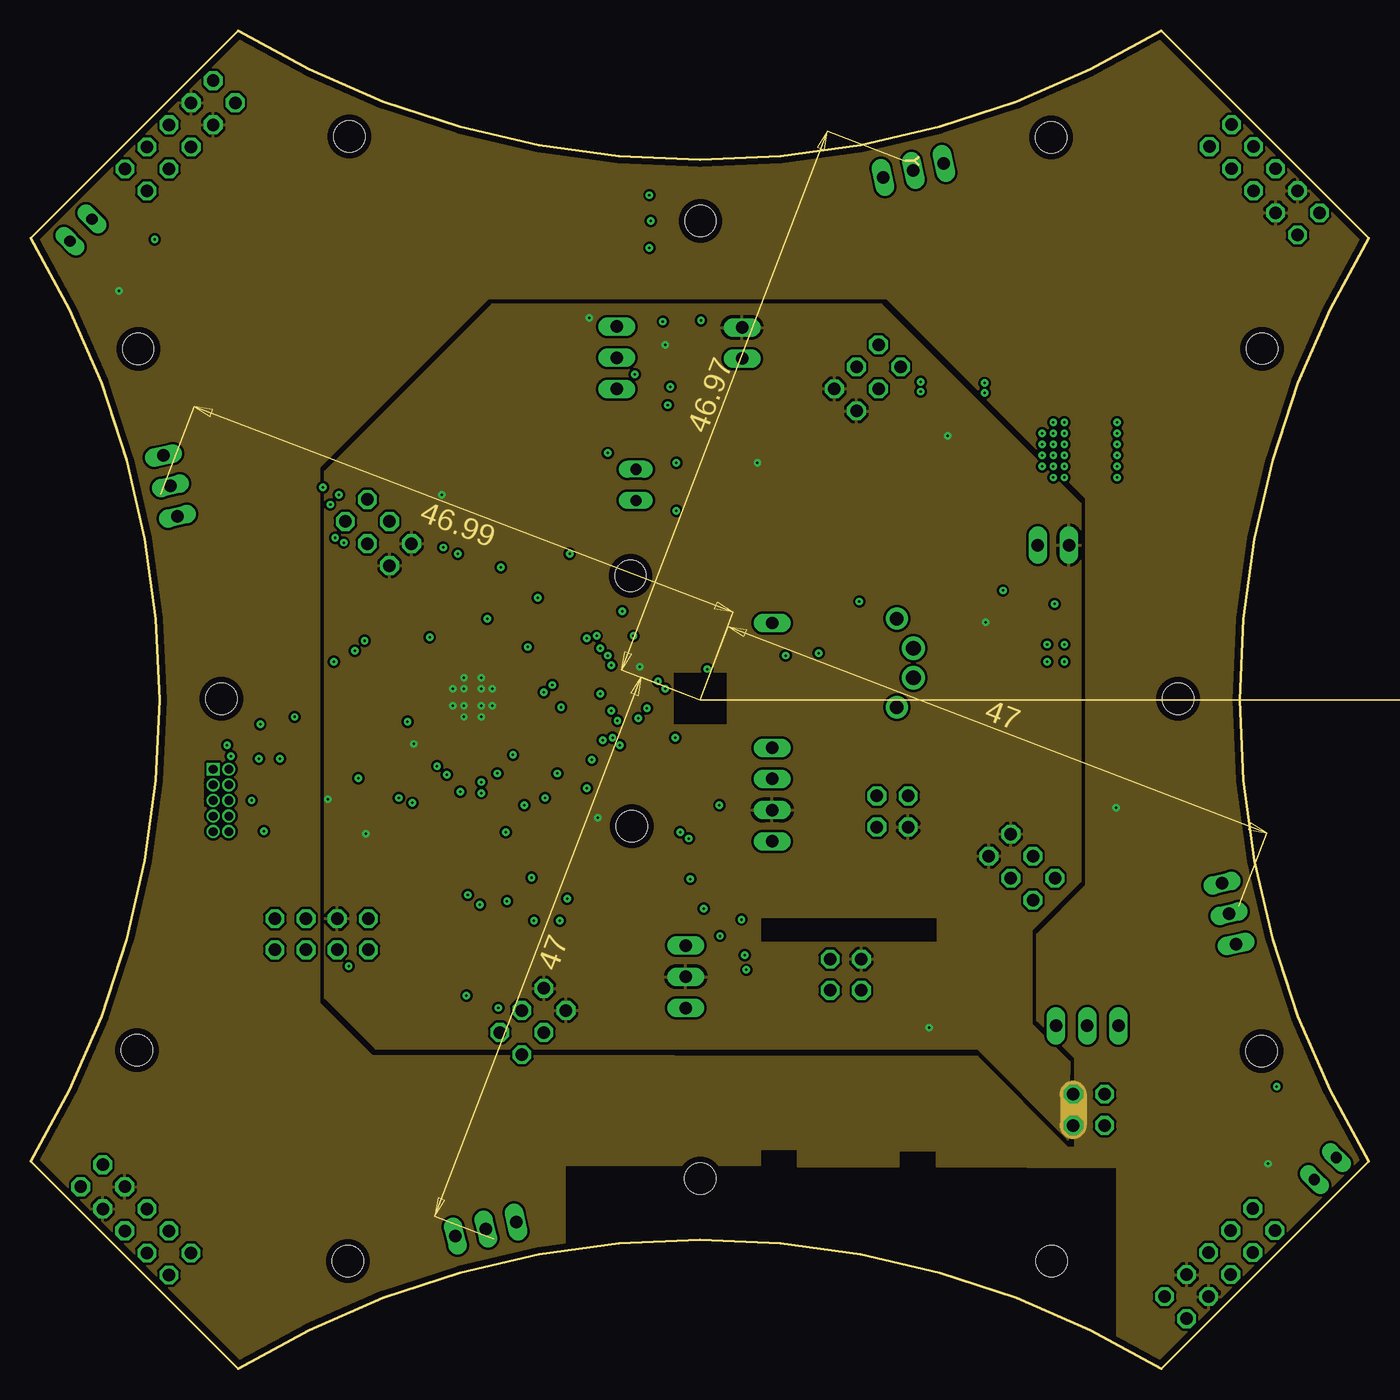
[diagram p4: board, inner layer PGND_DGND]
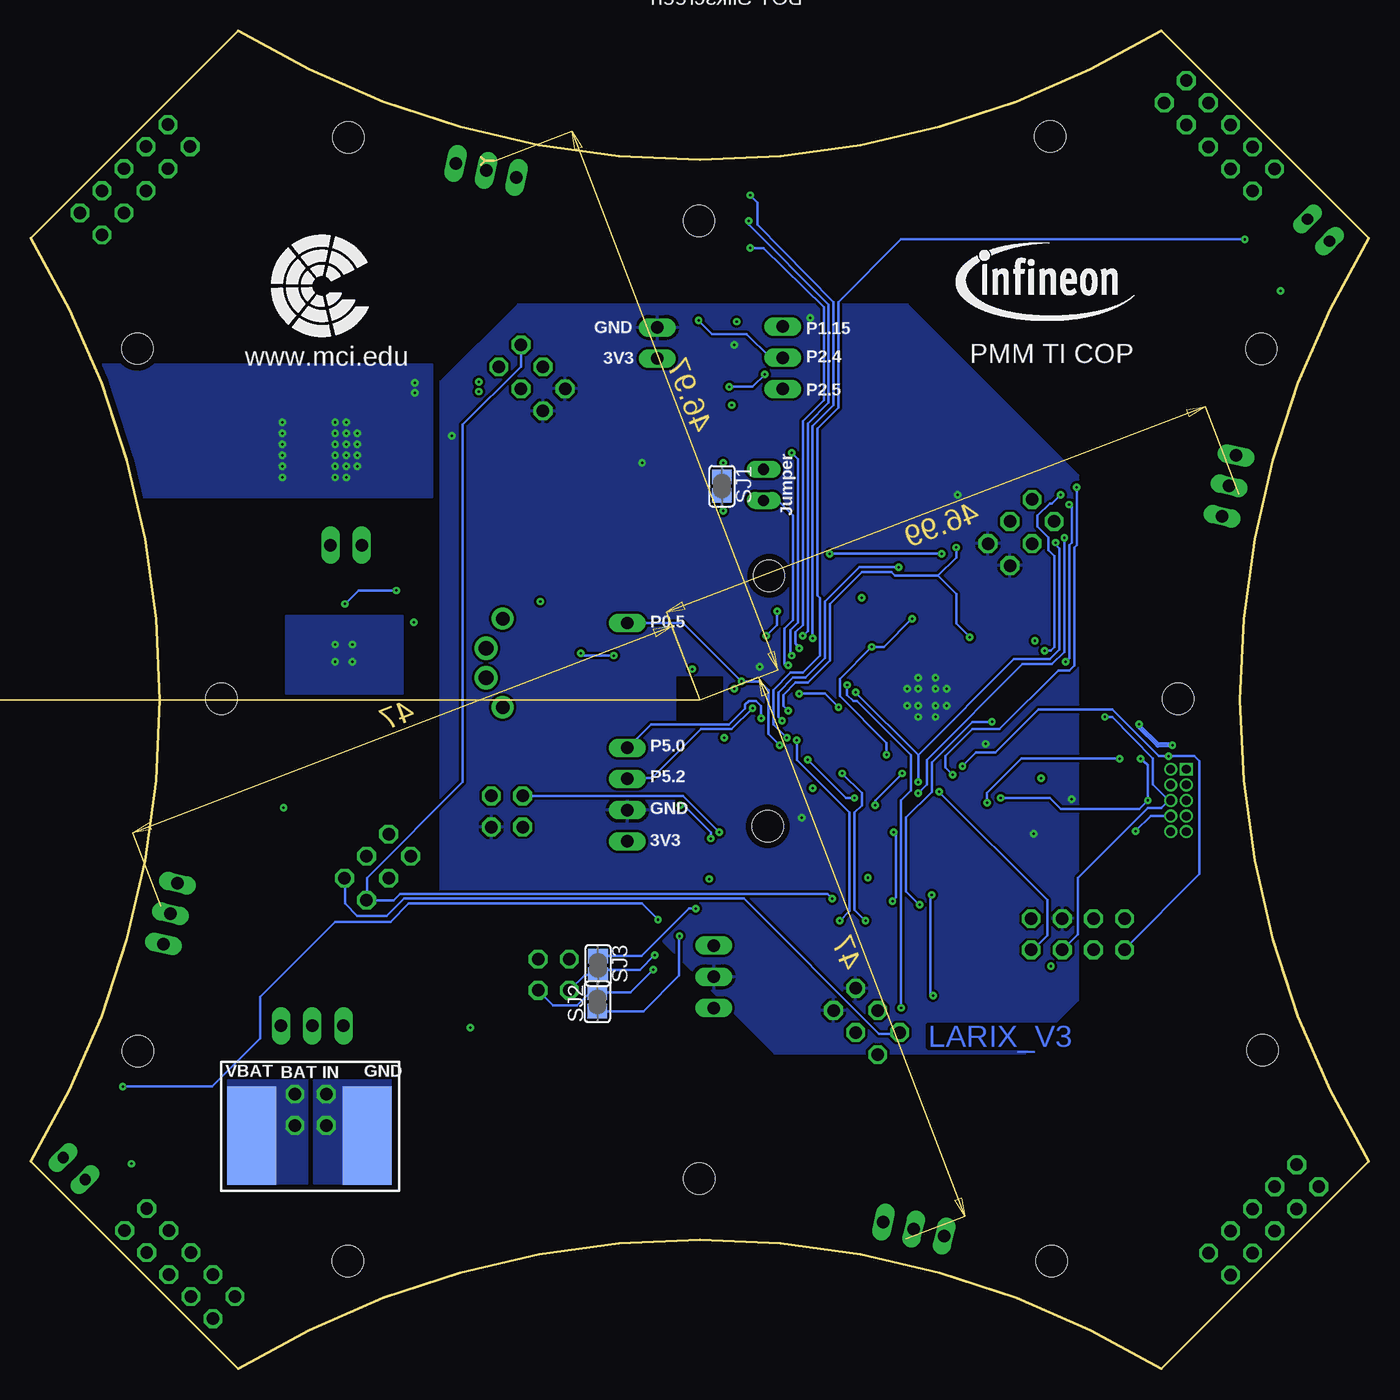
[diagram p5: board, bottom side, seen from below]

Size 109 x 109 mm. Coordinates in mm from the lower left corner, seen from the top.
Outline: 16.9,109 arc62 92.1,109 109,92.1 arc62 109,16.9 92.1,0 arc62 16.9,0 0,16.9 arc62 0,92.1 16.9,109
Copper layers (1+2*15+16): Top 0.035mm / dielectric 0.4mm / VCC_VDD 0.035mm / dielectric 0.71mm / PGND_DGND 0.035mm / dielectric 0.4mm / Bottom 0.035mm
Design rules "Hitzex_CPU_45A *": minimum track width 0.2mm, minimum drill 0.2mm, track to track 0.2mm, track to pad 0.2mm, pad to pad 0.2mm, via to via 0.2mm, smd to smd 0.2mm, copper to edge 0.5mm, drill to drill 0.5mm, minimum pad ring 7mil, minimum via ring 0.2mm, stop-mask expansion 4mil, vias tented up to drill 0.2mm, thermal gap 10mil
Holes 2.54 mm at 48.96,44.19 48.86,64.59 25.96,100.39 8.76,83.09 8.65,25.97 25.85,8.77 100.32,83.1 83.12,100.3 83.15,8.78 100.25,25.88 93.45,54.58 54.55,15.48 15.55,54.57 54.56,93.49
tRestrict: 8 lines
bRestrict: 4 lines
Milling: area 48.9,54.8 to 49.7,56.3; area 32.9,12.4 to 33.7,13.9; area 41.2,32.3 to 43.8,35.5; area 56.8,59.7 to 58.3,60.5; area 99.2,43.7 to 100.7,44.5; area 77.6,51.9 to 80.8,54.6; area 55.7,61.6 to 57.2,62.5; area 13.3,77.6 to 14.8,78.4; area 31.3,66.7 to 38.4,70.9; area 48.1,56.9 to 49,58.4; area 64.1,99.3 to 64.9,100.8; area 53.3,75.8 to 57.4,82.9; 19 lines

### Footprints (pad centres in the part's own frame; a part is rotated, then mirrored left to right if it is on the bottom)
INDUCTANCEWUERTZ47UH = smd 5.08 x 1.778: P$1 -5.08,5.08; P$2 -5.08,2.032
2X02 = drill 1.016 octagon: 1 -1.27,-1.27; 2 -1.27,1.27; 3 1.27,-1.27; 4 1.27,1.27
C0805K = smd 1.3 x 1.6: 1 -1,0; 2 1,0
C0603 = smd 1.1 x 1: 1 -0.85,0; 2 0.85,0
C1206K = smd 1.5 x 2: 1 -1.5,0; 2 1.5,0
C1206 = smd 1.6 x 1.8: 1 -1.4,0; 2 1.4,0
2X04 = drill 1.016 octagon: 1 -3.81,-1.27; 2 -3.81,1.27; 3 -1.27,-1.27; 4 -1.27,1.27; 5 1.27,-1.27; 6 1.27,1.27; 7 3.81,-1.27; 8 3.81,1.27
TSLP-3-1 = smd 0.225 x 0.35: 1 0.113,-0.475; 2 0.487,-0.475 | smd 0.6 x 0.35: 3 0.3,0.175
SOD323-R = smd 0.6 x 0.6: A 1.1,0; C -1.1,0
P/PG-LQFP-100-11 = smd 1.35 x 0.29: 1 -7.725,6; 2 -7.725,5.5; 3 -7.725,5; 4 -7.725,4.5; 5 -7.725,4; 6 -7.725,3.5; 7 -7.725,3; 8 -7.725,2.5; 9 -7.725,2; 10 -7.725,1.5; 11 -7.725,1; 12 -7.725,0.5; 13 -7.725,0; 14 -7.725,-0.5; 15 -7.725,-1; 16 -7.725,-1.5; 17 -7.725,-2; 18 -7.725,-2.5; 19 -7.725,-3; 20 -7.725,-3.5; 21 -7.725,-4; 22 -7.725,-4.5; 23 -7.725,-5; 24 -7.725,-5.5; 25 -7.725,-6; 51 7.725,-6; 52 7.725,-5.5; 53 7.725,-5; 54 7.725,-4.5; 55 7.725,-4; 56 7.725,-3.5; 57 7.725,-3; 58 7.725,-2.5; 59 7.725,-2; 60 7.725,-1.5; 61 7.725,-1; 62 7.725,-0.5; 63 7.725,0; 64 7.725,0.5; 65 7.725,1; 66 7.725,1.5; 67 7.725,2; 68 7.725,2.5; 69 7.725,3; 70 7.725,3.5; 71 7.725,4; 72 7.725,4.5; 73 7.725,5; 74 7.725,5.5; 75 7.725,6 | smd 0.29 x 1.35: 26 -6,-7.725; 27 -5.5,-7.725; 28 -5,-7.725; 29 -4.5,-7.725; 30 -4,-7.725; 31 -3.5,-7.725; 32 -3,-7.725; 33 -2.5,-7.725; 34 -2,-7.725; 35 -1.5,-7.725; 36 -1,-7.725; 37 -0.5,-7.725; 38 0,-7.725; 39 0.5,-7.725; 40 1,-7.725; 41 1.5,-7.725; 42 2,-7.725; 43 2.5,-7.725; 44 3,-7.725; 45 3.5,-7.725; 46 4,-7.725; 47 4.5,-7.725; 48 5,-7.725; 49 5.5,-7.725; 50 6,-7.725; 76 6,7.725; 77 5.5,7.725; 78 5,7.725; 79 4.5,7.725; 80 4,7.725; 81 3.5,7.725; 82 3,7.725; 83 2.5,7.725; 84 2,7.725; 85 1.5,7.725; 86 1,7.725; 87 0.5,7.725; 88 0,7.725; 89 -0.5,7.725; 90 -1,7.725; 91 -1.5,7.725; 92 -2,7.725; 93 -2.5,7.725; 94 -3,7.725; 95 -3.5,7.725; 96 -4,7.725; 97 -4.5,7.725; 98 -5,7.725; 99 -5.5,7.725; 100 -6,7.725 | smd 7 x 7: EXP 0,0
QFN3X3-24+ = smd 0.5 x 0.3: 1 -1.5,0.996; 2 -1.5,0.596; 3 -1.5,0.196; 4 -1.5,-0.204; 5 -1.5,-0.604; 6 -1.5,-1.004; 13 1.5,-0.996; 14 1.5,-0.596; 15 1.5,-0.196; 16 1.5,0.204; 17 1.5,0.596; 18 1.5,1.004 | smd 0.3 x 0.5: 7 -0.996,-1.5; 8 -0.596,-1.5; 9 -0.196,-1.5; 10 0.204,-1.5; 11 0.604,-1.5; 12 1.004,-1.5; 19 0.996,1.5; 20 0.596,1.5; 21 0.196,1.5; 22 -0.204,1.5; 23 -0.604,1.5; 24 -1.004,1.5 | smd 1.5 x 1.5: EXP 0,0
1X10 = drill 1.016 long: 1 -11.43,0; 2 -8.89,0; 3 -6.35,0; 4 -3.81,0; 8 6.35,0
1X03 = drill 1.016 long: 1 -2.54,0; 2 0,0; 3 2.54,0
JP1 = drill 0.914 long: 1 0,-1.27; 2 0,1.27
1X02 = drill 1.016 long: 1 -1.27,0; 2 1.27,0
L1608 = smd 1.1 x 1: 1 -0.85,0; 2 0.85,0
CHIPLED_0603 = smd 0.8 x 0.8: A 0,-0.75; C 0,0.75
2X03 = drill 1.016 octagon: 1 -2.54,-1.27; 2 -2.54,1.27; 3 0,-1.27; 4 0,1.27; 5 2.54,-1.27; 6 2.54,1.27
2X05 = drill 1.016 octagon: 1 -5.08,-1.27; 2 -5.08,1.27; 3 -2.54,-1.27; 4 -2.54,1.27; 5 0,-1.27; 6 0,1.27; 7 2.54,-1.27; 8 2.54,1.27; 9 5.08,-1.27; 10 5.08,1.27
32X25_4PAD = smd 1.4 x 1.2: 1 -1.1,-0.8; 2 1.1,-0.8; 3 1.1,0.8; 4 -1.1,0.8
R0603 = smd 1 x 1.1: 1 -0.85,0; 2 0.85,0
R0603' = smd 0.67 x 1: 1 -0.715,0; 2 0.715,0
SJ = smd 1.168 x 1.6: 1 -0.762,0; 2 0.762,0
FSM2JSMA = smd 2.1 x 1.3: P -4.55,-2.3; P1 4.55,-2.3; S -4.55,2.3; S1 4.55,2.3
SOT223 = smd 1.219 x 2.235: 1 -2.311,-3.099; 2 0,-3.099; 3 2.311,-3.099 | smd 3.6 x 2.2: 4 0,3.099
INF-PG-DSO-8-27_N_1PRIMARY = smd 1.55 x 0.6: 1 -2.65,1.905; 2 -2.65,0.635; 3 -2.65,-0.635; 4 -2.65,-1.905; 5 2.65,-1.905; 6 2.65,-0.635; 7 2.65,0.635; 8 2.65,1.905 | smd 2.85 x 3.2: 9 0,0
LGA8R125P0X4_500X300X120 = smd 0.35 x 0.35: P1 0.725,0.975; P2 0.725,0.325; P3 0.725,-0.325; P4 0.725,-0.975; P5 -0.725,-0.975; P6 -0.725,-0.325; P7 -0.725,0.325; P8 -0.725,0.975
TSLP-2-20 = smd 0.6 x 0.35: P$1 0.1,0.4; P$2 0.1,-0.3
WLB-5 = smd 0.25 x 0.25: A1 -0.19,-0.27; A2 -0.19,0.23; B2 0.31,0.23; C1 0.81,-0.27; C2 0.81,0.23
BATT-SOLDER = smd 4 x 8: P$1 0,0
RN42+SHIELD = smd 2 x 0.8: GND1 0,16; GND2 0,2.8; GPIO_2 13.4,10; UART_CTX 13.4,6.4; UART_RTX 13.4,5.2; UART_RX 13.4,2.8; UART_TX 13.4,4; VDD 0,4 | smd 0.8 x 2: GND3 3.6,0; GND4 9.8,0
INF-SOD323_V_1PRIMARY = smd 0.762 x 1.016: 1 0,1.25; 2 0,-1.25
SC74 = smd 0.5 x 0.5: P_1 -0.05,-2.2; P_2 0.9,-2.2; P_3 1.85,-2.2; P_4 1.85,0.2; P_5 0.9,0.2; P_6 -0.05,0.2
USBVERTICAL = smd 0.4 x 1.5: 1 1.3,2.72; 2 0.65,2.72; 3+ 0,2.72; 4 -0.65,2.72; 5 -1.3,2.72 | drill 1.2 pad 1.9: P$1 1.2,0; P$2 -1.2,0 | drill 1.1 pad 1.8: P$3 -3.61,1.34; P$4 3.61,1.34
SC79 = smd 0.508 x 0.762: 1 -0.675,0; 2 0.675,0
FTSH-105-01-F-D-K = drill 0.7 pad 1.05 square: 1 -2.54,-0.635 | drill 0.7 pad 1.05: 2 -2.54,0.635; 3 -1.27,-0.635; 4 -1.27,0.635; 5 0,-0.635; 6 0,0.635; 7 1.27,-0.635; 8 1.27,0.635; 9 2.54,-0.635; 10 2.54,0.635

### Placement (x,y rotation side)
47UH  77.8,44.4 270 top
47µH  83.9,46.3 270 top
BAT_IN  86.2,21.1 270 top
C1  22.52,59.94 90 top
C2  23.02,49.29 180 top
C3  42.8,64.5 45 top
C4  24.33,60.15 90 top
C5  24.3,47.4 180 top
C6  44.8,46.3 315 top
C7  44.5,62.5 45 top
C8  27,61.18 180 top
C9  43.86,45.36 315 top
C10  26.17,44.27 270 top
C11  28.69,45.13 315 top
C12  21.73,46.63 90 top
C13  24.8,41.9 0 top
C14  50.65,83.46 270 top
C15  50.65,80.16 270 top
C16  30.13,63.53 45 top
C17  26.6,63.8 90 top
C18  53.7,49.7 0 top
C19  51.8,57.1 0 top
C20  17.93,59.15 0 top
C21  51.4,52.9 270 top
C22  77.46,75.04 90 top
C23  81.82,79.34 180 top
C24  87.6,58.3 270 top
C25  86.14,15.75 180 top
C26  83.4,63.4 0 top
C27  86.14,24.09 180 top
C28  55.7,71.4 90 top
C29  35.32,69.27 90 top
C30  33.57,69.26 90 top
C31  37.26,69.27 90 top
C32  86.2,17.9 180 top
C33  86.7,47.4 180 top
C34  82,53.5 180 top
C35  79.3,59.5 180 top
C36  80.3,62.5 270 top
C37  77.3,32.7 90 top
C38  75.4,32.9 90 top
CON1  23.7,35.4 0 top
D1  66.49,55.95 90 top
D2  66.41,61.48 180 top
IC1  35.99,54.69 225 top
IC2  54.5,54.5 180 top
JP1  60.4,54.4 90 top
JP2  66.4,32.1 180 top
JP3  47.75,82.36 90 top
JP4  49.3,72 180 top
JP5  83.3,67.1 0 top
JP6  57.95,83.56 90 top
JP10  4.1,92.76 315 top
JP11  105.46,16.31 135 top
JP15  11.38,71.92 103 top
JP16  71.9,97.62 13 top
JP17  97.61,37.08 283 top
JP18  37.07,11.39 193 top
JP19  86.07,27.94 180 top
JP24  70.2,45.4 90 top
L1  66.22,59.88 0 top
L2  23.6,65.5 180 top
L3  23.61,63.23 180 top
LED1  78.22,27.01 180 top
LED2  50.3,75.8 270 top
LED3  46.3,91.3 90 top
LED4  46.3,95.6 90 top
LED5  46.3,93.5 90 top
LED6  81.63,81.25 90 top
M1/DY  28.33,68.12 135 top
M1/MOTOR  12.17,100.44 45 top
M2/DY  68.16,80.72 45 top
M2/MOTOR  100.51,96.86 315 top
M3/DY  80.74,40.86 315 top
M3/MOTOR  96.86,8.57 225 top
M4/DY  40.91,28.3 225 top
M4/MOTOR  8.56,12.13 135 top
Q1  21.5,42.9 270 top
R1  17.93,68.15 0 top
R2  20R  [R0603']  54.8,74.4 0 top
R3  25R  [R0603']  57,73.9 90 top
R4  1k  [R0603']  53.3,72.1 90 top
R5  680R  [R0603']  84.1,81.29 0 top
R6  680R  [R0603']  76.78,27.05 270 top
R7  330k  [R0603']  51.7,71.8 270 top
R8  4.7k  [R0603']  56.63,39.22 270 top
R9  4.7k  [R0603']  54.85,39.23 270 top
R10  66.21,58.13 180 top
R11  66.23,54.61 180 top
R12  510R  [R0603']  24,44 270 top
R13  30k  [R0603']  88.7,31 90 top
R14  56.8,48.5 270 top
R15  55.4,51.4 180 top
R16  53.75,84.26 0 top
R17  53.95,79.06 0 top
R18  10k  [R0603']  87.4,31 270 top
R19  10k  [R0603']  84.8,31 270 top
R20  680R  [R0603']  47.7,75.8 180 top
R21  680R  [R0603']  48.8,91.3 0 top
R22  680R  [R0603']  48.8,95.6 0 top
R23  680R  [R0603']  48.8,93.5 0 top
R24  22k  [R0603']  79,61.5 270 top
R26  8.05,89.22 180 top
R27  101.6,17.82 180 top
R28  30k  [R0603']  86.1,31 90 top
R29  30k  [R0603']  82.1,31 90 top
R30  10k  [R0603']  83.4,31 270 top
R31  37.16,40.42 45 top
R32  38.29,39.26 45 top
R33  39.37,42.76 225 top
R34  40.61,41.54 225 top
R35  n.m.  [R0603']  23.8,68.4 270 top
R36  n.m.  [R0603']  42.99,43.32 225 top
R37  n.m.  [R0603']  42.15,38.35 180 top
R38  n.m.  [R0603']  36.54,29.16 135 top
RC  53.36,31.94 90 top
SJ1  52.7,71.9 270 bottom
SJ2  62.84,29.89 90 bottom
SJ3  62.79,32.86 270 bottom
SW3  17.93,63.55 270 top
TO3.3V  83.38,74.93 270 top
U$7  83.5,58.3 270 top
U$8  53.25,81.66 0 top
U$9  54.4,70.2 180 top
U$11  57.7,71.1 90 top
U$12  91,19 0 bottom
U$13  73.3,36.5 180 top
U$14  81.6,19 0 bottom
U$16  85.9,45.7 270 top
U$18  8.97,90.72 180 top
U$20  102.55,19.41 180 top
U$22  58.4,74.2 180 top
USB  71.9,57.5 90 top
V1  17.2,42.1 0 top
X1  15.5,46.3 270 top

### Tracks (layer width: path | path; a pad name or v marks a point on that pad's centre or on a via)
AGND
  Top 0.2: C17.2 26.65,64.7 27.9,64.7 28.47,64.13 C16.2 30.8,64.13 IC1.32 33.5,61.43 33.5,61.2 33.1,60.8 32.71,60.8 IC1.34
COOLING  (via drill 0.2)
  Top 0.2: v84.2,57.6 U$7.9
  other vias: 84.2,59 82.8,59 82.8,57.6
  pour Bottom: 78.7,61.3 88.2,61.3 88.2,55 78.7,55
GND  (via drill 0.2)
  Top 0.2: C14.2 C15.1 | U$8.P7 51.27,81.98 C14.2 | U$13.GND4 U$13.GND3 69.7,35.44 JP2.1 68,33.7 U$13.GND2 | R30.2 R19.2 84.8,30.4 85.4,31 86.69,31 R18.2 | 100.7,17.87 R27.2 | LED6.C 80.82,81.21 C23.2 | C2.2 22.02,47.77 C12.2 21.81,47.4 C5.2 23.45,47.15 | C14.2 50.91,82.61 v51.7,83.4 | U$22.P$1 v59.2,73.8 | C9.2 C6.2 45.5,45.6 v46.2,44.9 | C10.2 26.32,43.22 | IC1.63 31.2,49.9 v31.2,50.9 30.8,51.3 29.77,51.3 IC1.59 | IC1.EXP v35.3,54 | C30.2 33.5,70.18 v33.5,71.2 | X1.3 X1.5 | IC2.20 53.9,52.3 | IC2.18 52.3,53.5 | C13.2 26.17,42.42 C10.2 | C10.2 26.35,43.6 v27.3,43.6 27.9,43.6 28.72,44.42 C11.2 | C35.2 78.45,60.23 R24.2 77.81,60.78 v77.8,60.8 | U$16.1 v88.4,45.7
  Top 0.406: 85.23,24.13 C27.2 | C27.2 85.29,22.73 BAT_IN.1 | C27.2 84.8,24.68 R19.2 | R27.2 100.75,16.75 v100.8,16.7 | U$20.P_4 100.7,17.87 | C23.2 80.82,77.78 TO3.3V.1 79.92,77.6 78.1,77.6 77.46,76.96 C22.2 77.42,76 v74.7,76 | U$18.P_4 7.2,90.44 R26.2 v7.2,87.8 | C24.1 86.45,60.95 U$7.1 U$7.2 | C33.1 87.55,46.1 U$16.1
  Top 0.6: JP5.2 84.57,63.73 C26.2 85,63.3 85,62.4 85.41,61.99 U$7.1
  Top 0.61: C32.2 84.8,16.09 C25.2
  Top 1.27: C32.2 84.8,19.7 BAT_IN.3
  PGND_DGND 2.184: BAT_IN.1 BAT_IN.3
  other vias: 45.5,85.6 24.2,46.4 34.4,55.4 35.3,55.4 35.3,56.3 36.7,56.3 36.7,55.4 37.6,55.4 37.6,54 36.7,54 36.7,53.1 35.3,53.1 34.4,54 49.6,57.2 73.18,27.8
  pour PGND_DGND: 77.1,26.1 73.8,26.1 73.9,36.8 59.4,36.8 59.4,34.7 73.8,34.7 73.7,26.1 28.1,26.1 24,30.2 24,54.2 52.3,54.2 52.3,52.4 56.8,52.4 56.8,56.8 52.3,56.8 52.3,54.3 24,54.3 24,73.1 37.6,86.7 69.3,86.7 85.5,70.5 85.5,39.7 81.5,35.7 81.5,28.1 84.6,25 84.5,18.7
  pour PGND_DGND: 16.9,109 21.2,106.6 28.4,103.4 35.3,101 42.1,99.5 51.4,98.6 55.3,98.5 55.3,87.2 37.3,87.2 23.5,73.4 23.5,29.8 27.8,25.5 77.1,25.4 84.5,18 85.1,18 85.1,25.3 82,28.4 82,35.4 86,39.4 86,70.9 69.7,87.2 55.4,87.2 55.4,98.5 59,98.7 67.4,99.7 74.6,101.4 83.5,104.5 89.8,107.7 92.1,109 109,92.1 106.4,87.4 104.4,83 102.5,78.4 100.6,72.1 99.2,64.8 98.5,57.5 98.6,52.6 99.1,44.6 101,35.8 103.9,26.7 107.5,19.4 109.1,16.8 92,-0.1 88.5,1.8 88.5,16.4 73.8,16.5 73.8,17.8 70.7,17.8 70.7,16.5 62.5,16.5 62.5,17.9 59.4,17.9 59.4,16.6 43.5,16.6 43.5,9.6 40.6,9.1 31.2,6.5 26.1,4.5 20.1,1.7 16.9,-0.1 0,16.9 3.2,22.8 6,29.2 8.2,36.6 9.8,44.2 10.1,46.8 14,46.8 14,45.7 15.5,45.7 15.5,48.2 14,48.2 14,46.9 10.1,46.9 10.4,50.6 10.5,56.7 9.5,66.7 7.4,75.6 4.8,82.8 1.6,89.3 0,92.2
  pour Top: 29.1,96.7 66.5,96.7 75.6,87.6 75.6,35 80,30.6 80,25 73.4,18.4 21.2,18.4 12.6,27 12.6,66.2 18.6,72.7 18.6,86.2
  pour Bottom (no thermals): 85.9,23.5 79.7,23.5 79.7,15.1 85.9,15.1
  pour Bottom: 37.6,86.7 69.3,86.7 75.6,80.4 75.6,37.5 60.2,37.5 48.4,25.7 28,25.7 23.7,30 23.7,72.8
N$1
  Top 0.2: R20.1 LED2.A
N$2
  Top 0.2: U$11.B2 57.09,71.41 56.5,72 55.95,72 C28.2 55.52,72.44 R2.2
N$3
  Top 0.2: LED3.A R21.1
N$4  (via drill 0.2)
  Top 0.2: C36.1 79.25,63.35 v79.2,63.4 | U$7.3 82.86,61.77 v83.4,62.3
  Bottom 0.2: v83.4,62.3 82.3,63.4 v79.2,63.4
N$6
  Top 0.2: IC1.62 26.69,46.1 25.6,46.1 24.21,44.72 R12.1
N$7
  Top 0.2: Q1.3 23.85,41.8 C13.1 23.95,43.23 R12.2
N$8
  Top 0.2: Q1.1 20.7,44.75 C12.1 24.58,45.78 25.3,46.5 26.39,46.5 IC1.61
N$9
  Top 0.2: R4.2 52,72.81 R7.1 | R7.1 50.05,72.52 JP4.1 | U$22.P$2 58.19,74.61 R3.2 56.12,75.5 53.3,75.5 51.7,73.9 R7.1
N$10  (via drill 0.2)
  Top 0.2: U$9.P$2 54.3,74.19 R2.1 53.2,74.4 v52.6,73.8
  Bottom 0.2: SJ1.1 52.7,73.7 v52.6,73.8
N$11
  Top 0.2: USB.1 68.7,58.8 67.6,59.9 67.1,59.9 L1.2
N$12
  Top 0.2: U$11.C2 57.47,72.72 R3.1
N$13
  Top 0.2: USB.2 67.09,58.15 R10.1 67.06,56.54 D1.2
N$14
  Top 1.27: M1/MOTOR.6 M1/MOTOR.5 16.9,95.71 16.9,73.2 13.15,69.45 JP15.1
N$15
  Top 0.2: LED6.A 82.42,81.29 R5.1
N$16  (via drill 0.2)
  Top 0.2: R37.1 43.65,38.35 v43.7,38.3
  Bottom 0.2: M2/DY.6 69.06,81.64 73.8,76.9 73.8,47.8 81.6,40 81.6,38.21 M3/DY.5 79.43,38.17 78.9,38.7 44.1,38.7 v43.7,38.3
N$17
  Top 0.2: C36.2 79.73,62.22 R24.1
N$18
  Top 0.2: R6.1 LED1.A
N$19
  Top 0.2: 16.12,43.75 X1.10 16.13,42.49 V1.1
N$20
  Top 0.2: IC2.10 54.3,56.8 54,57.1 C19.2
N$21
  Top 1.27: M1/MOTOR.4 M1/MOTOR.3 14.6,94.41 14.6,74.4 12.11,71.91 JP15.2
N$22
  Top 0.2: LED4.A R22.1
N$24
  Top 0.2: R23.1 LED5.A
N$25
  Top 1.27: M1/MOTOR.2 M1/MOTOR.1 12.2,93.22 12.19,75.78 JP15.3
N$26
  Top 0.2: U$13.GPIO_2 76.61,26.5 R6.2
N$27
  Top 0.2: U$13.UART_RTX U$13.UART_CTX
N$28
  Top 0.406: U$7.8 86.56,56.8 C24.2 88.98,55.42 47µH.P$1
N$30
  Top 0.406: 82.86,53.52 C34.1 | 82.85,49.51 47UH.P$1 82.88,47.47 U$16.2
  Top 0.6: U$7.6 82.86,53.52 | C34.1 82.85,49.51
N$31
  Top 0.406: U$18.P_6 8.9,90.4 R26.1
N$32
  Top 0.406: U$18.P_5 U$18.P_2 U$18.P_3 5.73,92.92 JP10.2
N$33
  Top 0.2: U$20.P_6 102.6,17.97 R27.1
N$34
  Top 0.406: U$20.P_3 U$20.P_2 101.65,20.5 | 101.65,20.5 U$20.P_5 | JP11.2 104.56,15.74 103.8,16.5 103.8,19.7 103,20.5 101.65,20.5
N$35
  Top 1.27: M2/MOTOR.6 M2/MOTOR.5 96.45,92.8 72.73,92.8 69.43,96.12 JP16.1
N$36
  Top 0.2: USB.3+ 68.2,57.5 67.9,57.2 67.9,56.4 67.6,56.1 67,56.1 D1.1 66.97,54.72 R11.1
N$37
  Top 0.2: R13.1 88.7,28.03 JP19.1
N$38
  Top 1.27: M2/MOTOR.2 M2/MOTOR.1 93.56,97.1 75.46,97.11 JP16.3
N$40
  Top 1.27: M2/MOTOR.4 M2/MOTOR.3 95.06,95 73.83,95 71.9,96.93 JP16.2
N$41
  Top 0.2: R28.1 86.1,27.97 JP19.2
N$42
  Top 1.27: M4/MOTOR.6 M4/MOTOR.5 13.23,16.8 35.9,16.8 39.56,13.14 JP18.1
N$43
  Top 0.2: R29.1 82.1,29.37 JP19.3
N$45
  Top 1.27: M4/MOTOR.2 M4/MOTOR.1 15.52,11.9 33.5,11.91 JP18.3
N$46
  Top 1.27: M4/MOTOR.4 M4/MOTOR.3 14.42,14.4 34.8,14.4 37.07,12.13 JP18.2
N$47
  Top 0.6: U$7.5 81.59,54.99 81.2,54.6 81.2,53.55 C34.2
N$49
  Top 1.27: M3/MOTOR.6 M3/MOTOR.5 93.3,12.13 93.31,36.67 96.19,39.55 JP17.1
N$50
  Top 1.27: M3/MOTOR.4 M3/MOTOR.3 95.4,13.62 95.43,35.54 96.97,37.08 JP17.2
N$53
  Top 1.27: M3/MOTOR.2 M3/MOTOR.1 99.59,13.01 97.4,15.2 97.4,34.4 97.6,34.6 JP17.3
N$54
  Top 0.2: M4/DY.5 38.21,27.48 R38.1
  Bottom 0.2: M4/DY.5 38.31,27.3 39.9,27.3 50.9,38.3 78.6,38.3 80,36.9 82.4,36.9 83.4,37.9 83.4,39.93 M3/DY.6
N$55
  Top 0.2: R35.1 25.55,69.1 M1/DY.6 25.7,69.08 25.7,71.7 28.6,74.6 38.7,74.6 41.4,77.3 64.66,77.3 68.98,81.62 M2/DY.5
P0.0  (via drill 0.2)
  Top 0.2: M4/DY.6 40.01,27.49 v38.1,29.4 30.83,36.67 CON1.8 | IC1.2 44.68,55.6 42.6,55.6 v42.5,55.7
  Bottom 0.2: v38.1,29.4 38.1,46.3 37.3,47.1 37.3,50 41.7,54.4 42,54.4 42.5,54.9 v42.5,55.7
P0.1  (via drill 0.2)
  Top 0.2: v41.8,55.1 44.9,55.1 45.7,55.9 IC1.1 | v40.2,45.9 41.43,45.9 R36.1 | v25.5,67.3 25.9,67.7 26.1,67.7 27.43,69.03 M1/DY.5 | v35,47 35.9,47 v36.7,47.8 37.3,47.8 v38,48.5
  Bottom 0.2: v38,48.5 40.2,46.3 v40.2,45.9 | v41.8,55.1 36.7,50 | 36.7,50 v36.7,47.8 | v25.5,67.3 25.5,67.1 25.2,66.8 25.2,58.6 26,57.8 28.9,57.8 36.7,50 | CON1.7 27.37,34.13 26.2,35.3 26.2,38.2 v35,47
P0.2  (via drill 0.2)
  Top 0.2: IC1.100 46.23,53.47 48.7,51 48.7,49.4 57.9,40.2 v57.9,36.6 | U$20.P_1 102.6,21.9 v101.5,23
  Bottom 0.2: v57.9,36.6 59.2,37.9 78.2,37.9 79.7,36.4 84.2,36.4 90.3,30.3 90.3,26.9 94.2,23 v101.5,23
P0.3  (via drill 0.2)
  Top 0.2: v47.4,51.4 46.6,52.2 46.3,52.2 45.38,53.12 IC1.99
  Top 0.406: U$18.P_1 9.94,92 v10.1,92
  Bottom 0.2: v10.1,92 38.1,92 43.2,86.9 43.2,78.3 44.9,76.6 44.9,63 44.7,62.8 44.7,58.1 46.1,56.7 47.1,56.7 48.5,55.3 48.5,52.5 v47.4,51.4
P0.4  (via drill 0.2)
  Top 0.2: IC1.98 46.56,51.2 v46.6,51.2 | RC.3 51.14,36.7 43.3,36.7 v43.1,36.5
  Bottom 0.2: v43.1,36.5 42.3,37.3 42.3,45.3 46.6,49.6 v46.6,51.2
P0.5  (via drill 0.2)
  Top 0.2: v48,50.8 47.8,50.6 46.3,50.6 45.9,51 45.9,51.15 IC1.97 | IC2.12 v51.1,56
  Bottom 0.2: v48,50.8 48.9,51.7 48.9,55.3 49.6,56 v51.1,56 55.85,60.75 JP1.8
P0.7  (via drill 0.2)
  Top 0.2: IC1.89 v42.9,48.5 | v41,36.5 40.8,36.7 35.5,36.7 33.4,38.8 21,38.8 19,40.8 v19,43.8
  Bottom 0.2: v42.9,48.5 41.3,46.9 41.3,45.9 41.9,45.3 41.9,37.4 v41,36.5 | v19,43.8 17.77,45.03 X1.8
P0.9  (via drill 0.2)
  Top 0.2: IC1.4 45.36,57.7 46.6,57.7 v47,58.1 | v47,74.6 47,75.78 R20.2
  Bottom 0.2: v47,58.1 47.1,58.2 47.1,60.2 46.5,60.8 46.5,74.1 v47,74.6
P0.10  (via drill 0.2)
  Top 0.2: IC1.3 45.67,57.3 v47.3,57.3
  Bottom 0.2: v47.3,57.3 47.5,57.3 47.6,57.4 47.6,60.3 46.9,61 46.9,69.5 48.2,70.8 49.23,70.8 JP4.2
P1.0
  Top 0.2: IC1.79 39.62,44.7 40.1,44.7 41.22,43.59 R34.1 41.82,42.14 R36.2
P1.1  (via drill 0.2)
  Top 0.2: R35.2 24.52,67.69 v24.8,67.7 | R33.1 39.97,43.64 IC1.78 37.91,45.7 v36.7,46.9
  Bottom 0.2: v24.8,67.7 24.8,58.4 25.8,57.4 28.2,57.4 36,49.6 36,47.6 v36.7,46.9
P1.2  (via drill 0.2)
  Top 0.2: IC1.77 38.7,44.21 v38.7,43.7 | R32.1 38.24,38.66 v38.8,38.1 39,37.9 40.99,37.9 R37.2
  Bottom 0.2: v38.7,43.7 38.5,43.5 38.5,38.4 v38.8,38.1
P1.3  (via drill 0.2)
  Top 0.2: IC1.76 38,44.2 38,43 36.1,41.1 36.1,40.4 36.56,39.94 R31.1 | 36.52,39.82 R31.1 | R31.1 35.6,38.86 v35.6,38.6 | v35.5,30.4 35.5,30.19 R38.2
  Bottom 0.2: v35.6,38.6 35.7,38.5 35.7,30.6 v35.5,30.4
P1.5  (via drill 0.2)
  Top 0.2: IC1.74 33.7,44.62 33.7,39.1 35.7,37.1 54.31,37.1 v56.15,35.26 56.63,35.74 R8.2
  Bottom 0.2: SJ2.1 59.09,29.13 56.19,32.03 56.19,35.22 v56.15,35.26
P1.5S  (via drill 0.2)
  Top 0.2: v58.3,32.5 U$13.UART_TX
  Bottom 0.2: JP2.2 66.44,29.6 64.5,29.6 63.45,30.65 SJ2.2 60.15,30.65 v58.3,32.5
P1.15  (via drill 0.2)
  Top 0.2: U$8.P5 52.52,80.42 v52.1,80 | IC1.68 33.24,48.4 v33.9,48.4 | v23.8,71.8 24,71.8 28,75.8 38.1,75.8 47.2,84.9 JP3.3 48.1,84.9 49.8,83.2 49.8,81.6 v49.2,81
  Bottom 0.2: v52.1,80 50.2,80 v49.2,81 | v33.9,48.4 34.5,49 34.5,49.9 32.3,52.1 30.1,52.1 25.3,56.9 24.4,56.9 24,57.3 24,66.9 23.8,67.1 v23.8,71.8
P2.1  (via drill 0.2)
  Top 0.2: IC1.51 25.91,53.1 v21.5,53.1
  Bottom 0.2: CON1.5 23.7,35.4 23.7,40 18,45.7 16.9,45.7 16.3,46.3 | v21.5,53.1 20.9,53.1 17.6,49.7 17.6,47.6 16.3,46.3 | 16.3,46.3 X1.6 16.1,46.3
P2.4  (via drill 0.2)
  Top 0.2: U$8.P4 53.41,80.69 53.3,80.8 53.3,83 53.6,83.3 54.3,83.3 54.6,83.6 R16.2 v54.6,85.4 | JP3.2 45.26,82.36 38.3,75.4 28.2,75.4 24.4,71.6 v24.4,70.4 | IC1.48 26.9,56.72 26,57.6 v24.7,57.6
  Bottom 0.2: v54.6,85.4 53.5,84.3 50.7,84.3 48.8,82.4 47.79,82.4 JP3.2 | v24.4,70.4 24.2,70.2 24.2,67.3 24.4,67.1 24.4,57.9 v24.7,57.6
P2.5  (via drill 0.2)
  Top 0.2: U$8.P3 54.01,81.3 54.5,81.3 54.8,81 R17.2 54.8,79 53.7,77.9 50.27,77.9 48.35,79.82 JP3.1 43.32,79.82 38.5,75 28.4,75 25.1,71.7 v25.1,71.2 | v26.4,58.5 26.4,57.9 27.33,56.97 IC1.47
  Bottom 0.2: v25.1,71.2 25.8,70.5 26,70.5 27,69.5 27,68.6 26.1,67.7 26.1,66.7 25.6,66.2 25.6,58.8 25.9,58.5 v26.4,58.5
P3.0  (via drill 0.2)
  Top 0.2: v50.4,95.6 R22.2 | v45.3,59.5 45.1,59.3 44.84,59.3 IC1.7
  Bottom 0.2: v45.3,59.5 45.3,76.8 43.6,78.5 43.6,86.9 49.8,93.2 49.8,95 v50.4,95.6
P3.1  (via drill 0.2)
  Top 0.2: IC1.6 45.15,58.9 45.7,58.9 46.1,59.3 v46.1,59.7 | v50.5,93.5 R23.2
  Bottom 0.2: v46.1,59.7 45.7,60.1 45.7,77 44,78.7 44,86.7 50.5,93.2 v50.5,93.5
P3.2  (via drill 0.2)
  Top 0.2: IC1.5 45.26,58.3 46,58.3 v46.4,58.7 | v50.4,91.3 R21.2
  Bottom 0.2: v46.4,58.7 46.7,59.1 46.7,60 46.1,60.6 46.1,77.2 44.4,78.9 44.4,86.5 49.3,91.3 v50.4,91.3
P3.5  (via drill 0.2)
  Top 0.2: IC1.91 43.21,49.6 44.2,49.6 44.8,50.2 47.3,50.2 53.6,43.9 v53.6,43.2 | JP24.3 70.2,45.4 68.1,45.4 66.8,46.7 56.8,46.7 56.1,46 v56.1,45.9
  Bottom 0.2: v53.6,43.2 53.6,43.7 55.8,45.9 v56.1,45.9
P4.0  (via drill 0.2)
  Top 0.2: IC1.85 41.9,46.66 v41.9,46.5 | v45.7,49.6 45.9,49.8 47.1,49.8 52.9,44 v52.9,43.7
  Bottom 0.2: v41.9,46.5 42.6,46.5 v45.7,49.6 | v52.9,43.7 55.87,46.67 JP24.4
P5.0  (via drill 0.2)
  Top 0.2: IC2.24 55.9,53 56.2,52.7 56.2,51.45 R15.1 57.06,50.59 JP1.4 | IC1.58 29.46,51.7 32.2,51.7 35.1,48.8 36.7,48.8 41.2,53.3 43.7,53.3 44.8,54.4 48.9,54.4 49.5,53.8 v49.5,53
  Bottom 0.2: v49.5,53 49.5,54 49.9,54.4 50.5,54.4 50.8,54.1 50.8,53.8 52.1,52.5 58.49,52.5 JP1.4
P5.1  (via drill 0.2)
  Top 0.2: v30.7,52.7 29.76,52.7 IC1.57 | v36.6,37.8 36.9,37.5 v54.81,37.5 v54.82,37.49 54.85,37.52 R9.2
  Bottom 0.2: 62.9,33.83 SJ3.1 59.26,33.62 55.39,37.49 v54.82,37.49 | v36.6,37.8 37.7,38.9 37.7,44.9 35.6,47 35.6,49.4 32.3,52.7 v30.7,52.7
P5.1S  (via drill 0.2)
  Top 0.2: U$13.UART_RX v58.17,33.7
  Bottom 0.2: JP2.4 63.86,32.1 SJ3.2 62.39,32.5 59.37,32.5 v58.17,33.7
P5.2  (via drill 0.2)
  Top 0.2: IC2.23 55.1,52.4 55.4,52.1 55.4,50.3 55.7,50 56.15,50 R14.1 58.1,48.05 JP1.3 | IC1.56 29.75,53.4 31.1,53.4 35.3,49.2 36.5,49.2 41,53.7 43,53.7 v43.2,53.9 | v46.4,55 49,55 v50.2,53.8
  Bottom 0.2: v43.2,53.9 44.3,55 v46.4,55 | JP1.3 59.1,48.05 59.02,48.12 58.38,48.12 54.4,52.1 51.9,52.1 v50.2,53.8
P14.5  (via drill 0.2)
  Top 0.2: R13.2 R18.1 87.4,34.5 85.5,36.4 81.3,36.4 73.8,43.9 73.8,51.3 73.3,51.8 66,51.8 59.9,57.9 58.2,57.9 56.2,59.9 49.3,59.9 v49.1,59.7 | C29.1 34.77,67.87 IC1.26 34.77,66.37 v34.8,66.4 | v48.2,61.71 v48.2,61.7 48.2,62.1 v43.9,66.4
  Bottom 0.2: v34.8,66.4 v43.9,66.4 | v48.2,61.7 48.2,60.6 v49.1,59.7
P14.7  (via drill 0.2)
  Top 0.2: R30.1 R29.2 82.1,33.3 75.5,39.9 58.8,39.9 49.1,49.6 49.1,51.2 47.8,52.5 v47.8,52.8 | C31.1 38.3,67.38 v38.3,65.3 38.3,64.8 37.57,64.07 IC1.24
  Bottom 0.2: v38.3,65.3 41.5,65.3 44.3,62.5 44.3,57.9 45.9,56.3 46.9,56.3 48.1,55.1 48.1,53.1 v47.8,52.8
P14.8  (via drill 0.2)
  Top 0.2: R28.2 R19.1 84.8,32.7 84.1,33.4 82.7,33.4 75.8,40.3 59,40.3 49.5,49.8 49.5,51.4 48.7,52.2 48.7,52.9 48,53.6 v47.3,53.6 | IC1.37 31.69,59.7 31.7,59.7 31.8,59.6 v32.5,59.6 | v33.6,66.9 33.57,66.93 C30.1
  Bottom 0.2: v47.3,53.6 47.7,54 47.7,54.9 46.7,55.9 45.7,55.9 43.9,57.7 43.9,62.3 41.3,64.9 38.9,64.9 38.6,64.6 35.1,64.6 | v32.5,59.6 33.6,60.7 33.6,63.1 35.1,64.6 | v33.6,66.9 33.6,66.1 35.1,64.6
RESET#  (via drill 0.2)
  Top 0.2: IC1.65 31.22,48.52 30,47.3 v30,46.5 | CON1.4 17.88,41.23 V1.2 18,42.23 v18,46.3 | v18.6,49.7 17.6,50.7 17.6,57.7 17.08,58.22 C20.1 | SW3.P1 15.78,59.15 C20.1 | C20.1 R1.1 17.03,68.1 SW3.P
  Bottom 0.2: v30,46.5 26,46.5 25.1,45.6 18.7,45.6 v18,46.3 18,49.2 v18.6,49.7
TCK  (via drill 0.2)
  Top 0.2: CON1.3 21.16,35.4 19.5,35.4 17.2,37.7 17.2,46.7 16.3,47.6 | v31.1,46.1 31.1,46.97 IC1.67 | v20.3,49.7 19.1,48.5 17.2,48.5 16.3,47.6 | X1.4 16.16,47.6 16.3,47.6
  Bottom 0.2: v20.3,49.7 28.3,49.7 31.1,46.9 v31.1,46.1
TMS  (via drill 0.2)
  Top 0.2: X1.2 16.3,49.01 v16.3,49.9 | IC1.66 32.52,49.1 v33.1,49.1
  Bottom 0.2: CON1.1 19.89,34.21 13.8,40.3 13.8,49.5 14.2,49.9 v16.3,49.9 17.1,49.9 20.9,53.7 26.9,53.7 30.4,50.2 32,50.2 v33.1,49.1
USB_D+
  Top 0.2: IC1.9 44.83,60.7 56.6,60.7 58.6,58.7 61.8,58.7 65.38,55.12 R11.2
USB_D-  (via drill 0.2)
  Top 0.2: R10.2 65.19,58.3 v64.2,58.3 | v61.5,58.1 61.3,58.3 58.4,58.3 56.4,60.3 45.14,60.3 IC1.8
  Bottom 0.2: v64.2,58.3 64,58.1 v61.5,58.1
VAREF
  Top 0.2: IC1.33 31.29,62.93 C16.1 29.47,62.93 28.9,63.5 28.4,63.5 28.1,63.8 25.6,63.8 25.5,63.9 25.5,64.45 L2.1
VBAT_IN
  Top 0.406: C27.1 86.99,22.85 BAT_IN.2
  Top 0.6: 86.73,37.07 85.85,37.95 C33.2 85.85,51.3 47µH.P$2 85.93,52.77 84.14,54.56 U$7.7
  Top 0.61: C27.1 88,24.1 90.4,26.5 90.4,33.4 86.73,37.07 | C32.1 87.6,16.21 C25.1
  Top 1.27: C32.1 87.6,19.7 BAT_IN.4
  pour VCC_VDD: 109,16.9 92,-0.1 88.5,1.9 88.5,16.4 73.8,16.5 73.8,17.9 70.7,17.9 70.7,16.5 62.5,16.5 62.5,17.9 59.4,17.9 59.4,16.5 43.5,16.5 43.5,9.5 40.1,8.9 37.2,8.3 33.8,7.4 29,5.7 23.6,3.5 19.6,1.4 17,-0.1 0,16.9 1.7,19.8 4.4,25.4 6.4,30.5 8.2,36.2 9.4,41.7 10.4,49.9 10.5,57.3 9.9,64 8.7,70.9 6.8,77.3 5.8,80.1 3.6,85.6 0.9,90.6 0,92.1 16.9,109 22.8,105.8 26.6,104.1 31.4,102.2 37.2,100.6 43,99.4 48.6,98.7 52.1,98.6 55.9,98.5 61.6,98.8 66,99.4 70.1,100.2 75.5,101.6 79.8,103 82.9,104.3 87.4,106.4 90.8,108.2 92.1,109 109,92.1 106.5,87.6 104.8,84 103,79.6 101.3,74.4 100,69.2 99.1,64 73.7,64 73.7,86.5 24.8,86.5 24.8,25.4 73.7,25.4 73.7,63.9 99.1,63.9 98.5,57.3 98.6,51 98.9,46.1 99.9,40.1 101.4,34 104.1,26.6 107.1,20.2
  pour Bottom (no thermals): 86.5,23.5 92.9,23.5 92.9,15.1 86.5,15.1
VBUS
  Top 0.2: D2.A 65.37,61.42 L1.1 62.58,59.88 61.8,59.1 58.8,59.1 56.8,61.1 44.52,61.1 IC1.10
VDD3.3  (via drill 0.2)
  Top 0.2: R4.1 53.3,70.6 v52.6,69.9 | C14.1 50.65,84.45 v51.5,85.3 52.1,85.3 52.4,85 R16.1 52.52,83.89 U$8.P8 | U$13.VDD 68.8,32.5 68.4,32.1 66.4,32.1 JP2.3 | 84,79.8 83.54,79.34 C23.1 | 24,49.31 C2.1 | 22.78,59.3 C1.1 | 22.75,65.55 L2.2 | C3.1 42.2,63.7 v41.3,62.8 41.3,62.83 IC1.17 39.4,60.93 39.4,59 40.2,58.2 40.91,58.2 IC1.11 | C21.2 51.85,52.05 v52.5,51.4 R15.2 | L3.2 | IC1.43 27.85,59.3 v27.2,59.3 | 24.6,59.2 C4.1 | v26.7,48.1 27.28,48.1 IC1.60 | IC2.8 v55.1,57 | IC2.13 51.8,55.5 v51.7,55.4 | R15.2 C18.2 56.6,47.65 R14.2 | R15.2 54.55,51.55 54.7,51.7 IC2.22 | IC1.87 42.18,47.8 43,47.8 43.9,46.9 C6.1 44.6,47.3 v45.3,47.3 | v25.9,32.8 24.3,32.8 23.7,33.4 23.7,34.7 23,35.4 21.8,35.4 20.9,36.3 20.26,36.3 CON1.2 | R17.1 52.46,79.06 v51.9,78.5 51.1,79.3 C15.2 51.5,80.16 51.5,80.8 52.03,81.34 U$8.P6 | R9.1 54.86,39.94 R8.1 53.77,39.94 v53.72,39.9
  Top 0.406: X1.1 14.87,49.66 v16,50.8 | 24,49.31 24,50.2 23.4,50.8 20.4,50.8 v18.7,52.5 | C4.1 22.78,59.3 | M1/DY.4 26.71,66.5 23.7,66.5 22.75,65.55 | C2.1 25.15,48.16 C5.1 26,47.4 v26.7,48.1 | L3.2 L2.2 20.1,65.5 18.8,66.8 18.8,68.13 R1.2 | v27.2,59.3 24.8,59.3 24.6,59.2 | C37.1 76.95,32.05 C38.1 74.95,32.5 U$13.VDD
  Top 0.813: v72.5,80.4 76.7,80.4 | v72.5,79.6 76.5,79.6
  VCC_VDD 0.61: 71.9,39.9 72,40 72.03,39.97 M3/DY.3 M3/DY.4
  Bottom 0.2: SJ1.2 52.7,70 v52.6,69.9
  Bottom 0.406: v16,50.8 17.2,50.8 18.7,52.3 v18.7,52.5
  other vias: 77.7,80.3 82.4,76.2 82.4,75.3 82.4,74.4 82.4,73.5 77.7,79.5 83.3,72.6 83.3,73.5 83.3,74.4 83.3,75.3 83.3,76.2 83.3,77.1 84.2,77.1 84.2,76.2 84.2,75.3 84.2,74.4 84.2,73.5 84.2,72.6 88.5,77.1 88.5,76.2 88.5,75.3 88.5,74.4 88.5,73.5 88.5,72.6
  pour Bottom: 76.3,81.8 103.7,81.8 100.4,71 76.3,71
  pour Top (no thermals): 103.8,81.8 76.3,81.8 76.3,71 100.3,71
  pour VCC_VDD: 73,85.8 73,54.4 56.6,54.4 56.6,56.6 52.4,56.6 52.4,52.4 56.6,52.4 56.6,54.3 73,54.3 73,36.9 59.4,36.9 59.4,34.7 73,34.7 73,26.2 25.7,26.2 25.7,85.8
VDD5  (via drill 0.2)
  Top 0.406: 39.97,40.94 R32.2 | 38.89,39.9 R31.2 | 37.76,41.16 R33.2 | v40.8,40 40.8,40.15 R34.2 | D2.C v67.51,62.49 v67.5,62.5
  Top 0.6: 47UH.P$2 79.45,49.86 79.45,57.65 80.1,58.3 80.1,59.45 C35.1 U$7.4 81.59,63.09 C26.1 82.03,63.53 JP5.1 82.03,70.87 TO3.3V.3
  Top 0.813: TO3.3V.3 78.88,72.62 C22.1 | R34.2 39.97,40.94 | R32.2 38.89,39.9 | R31.2 37.76,41.16
  VCC_VDD 0.813: v40.8,40 40.8,41.2 41,41.5 46.8,47.3 53.7,47.3 60.2,53.8 62.9,53.8 67.5,58.4 D2.C v67.51,62.49 | v67.51,62.49 67.51,62.81 71.9,67.2 81.93,67.2 JP5.1 | v67.51,62.49 v67.5,62.5
VDDA
  Top 0.2: IC1.35 31.01,61.8 28.9,61.8 27.75,62.95 C17.1 26.32,63.23 L3.1
VDDC  (via drill 0.2)
  Top 0.2: C8.1 28.4,60.63 28.4,59.4 29.06,58.74 IC1.42 29.86,58 32.2,58 35.3,61.1 v37.2,61.1 | C10.1 26.45,45.4 27,45.4 27.44,45.84 C11.1 | 27.54,45.44 C11.1 | C11.1 27.99,45.98 IC1.64 31.7,49.7 33.6,49.7 34.9,48.4 36.9,48.4 38.51,50.01 v39.29,50.01 39.29,49.98 IC1.86 43.26,46.01 C9.1 | C7.1 IC1.12 40.81,58.8 v40.5,58.8
  Bottom 0.2: v37.2,61.1 39.5,58.8 v40.5,58.8 43.1,56.2 43.1,54.8 39.29,50.99 v39.29,50.01

### Text on the board
Top: Layer 1 TOP
Bottom: Layer 2 BOT | LARIX_V3
tPlace: Assembly | BPL
Measures: [mm]
Reference: MPL | Mechanical drawing | [mm]
tSilk: TOP Silkscreen | State1 | U V W | State2 | W V U | U V W | State3 | VBAT | DPS310 | PMM TI COP | www.mci.edu | Origa | U V W | 5V | GND | MPU9x50 | USB | RESET | XMC4500 | 9250 | F100K1024 | GPS | P4.0 | P3.5 | 3V3 | GND | W V U | CORTEX / DEBUG | 3V3 | GND | RC-Control | P0.4 | BAT Safety | GND | Bluetooth | 3V3 | P5.1 | P1.5 | BAT IN | VBAT | FRONT | GND | VBAT | U V W | W V U | W V U
bSilk: BOT Silkscreen | GND | P1.15 | 3V3 | PMM TI COP | P2.4 | www.mci.edu | P2.5 | Jumper | P0.5 | P5.0 | P5.2 | GND | 3V3 | GND | BAT IN | VBAT